# EAGLE schematic STM32F446 front pane - south - v3 (EAGLE 9.6.2)

## Sheet 1 of 3
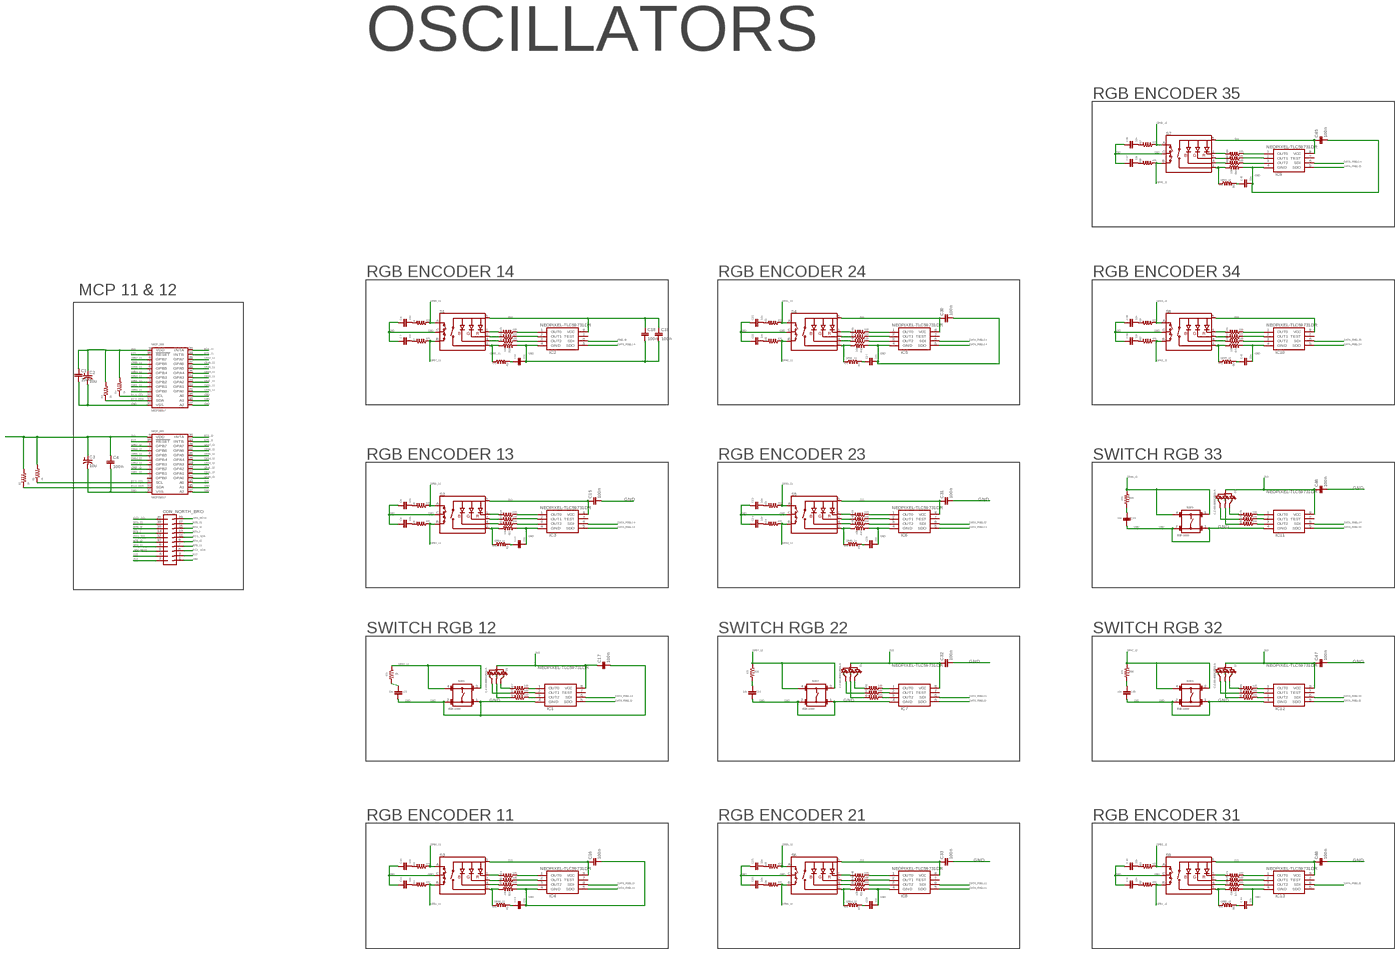
[diagram p0: schematic, sheet 1, overview]
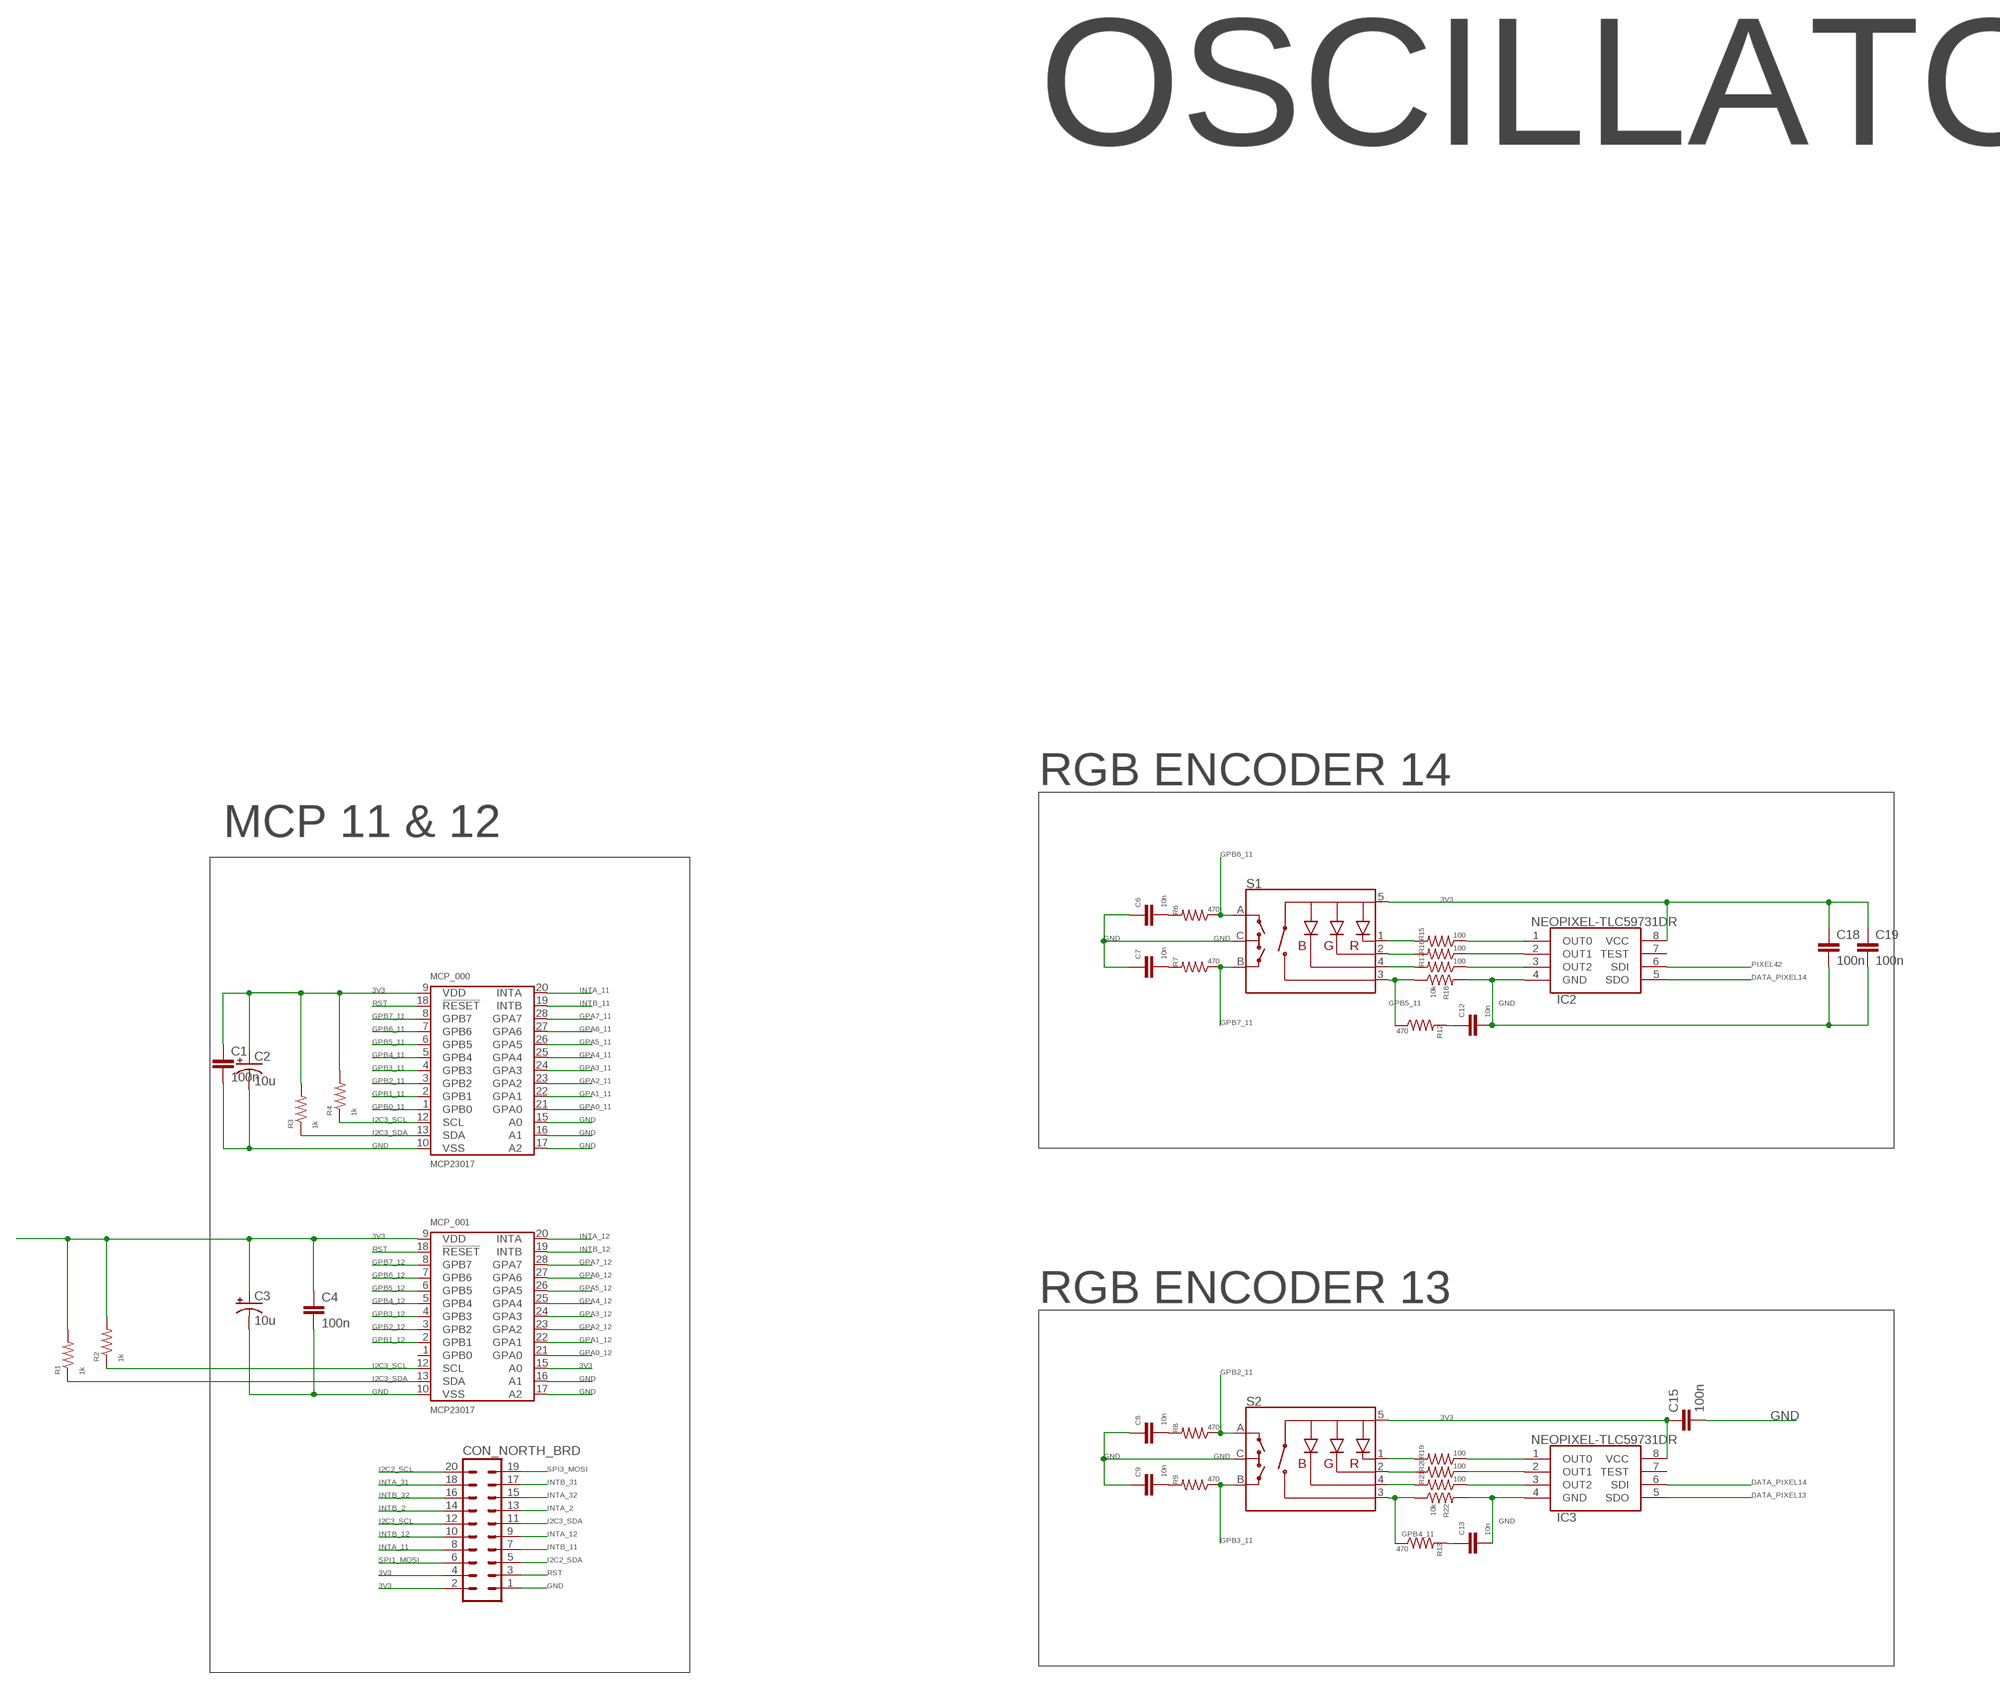
[diagram p1: schematic, sheet 1, part 1 of 4]
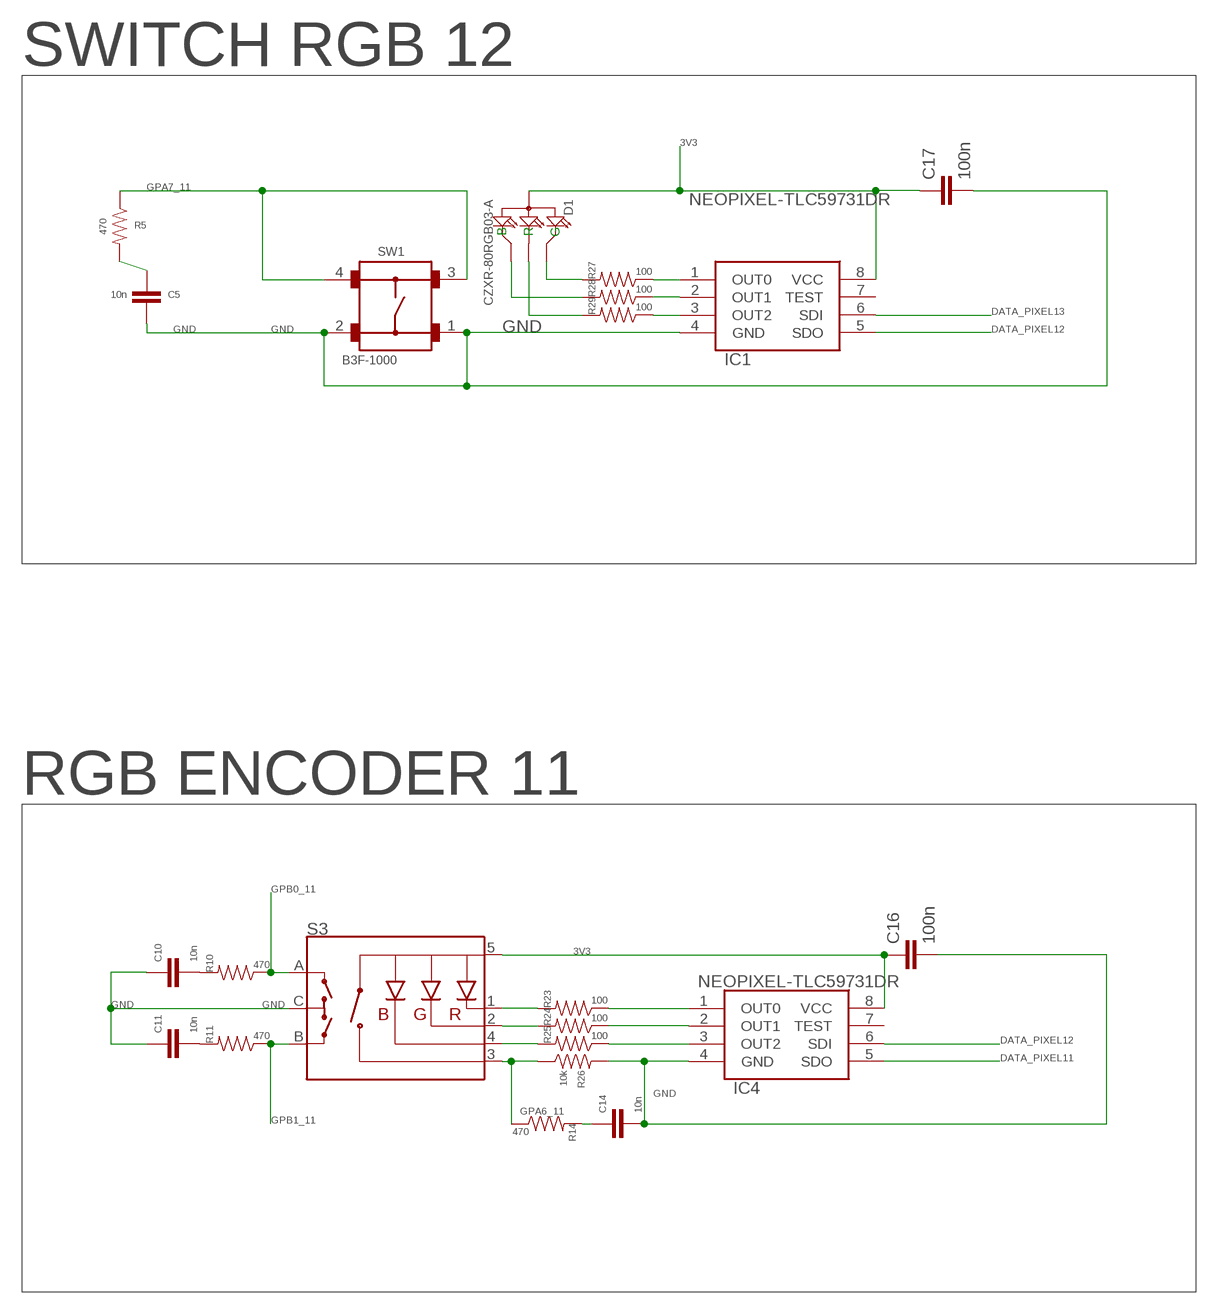
[diagram p2: schematic, sheet 1, part 2 of 4]
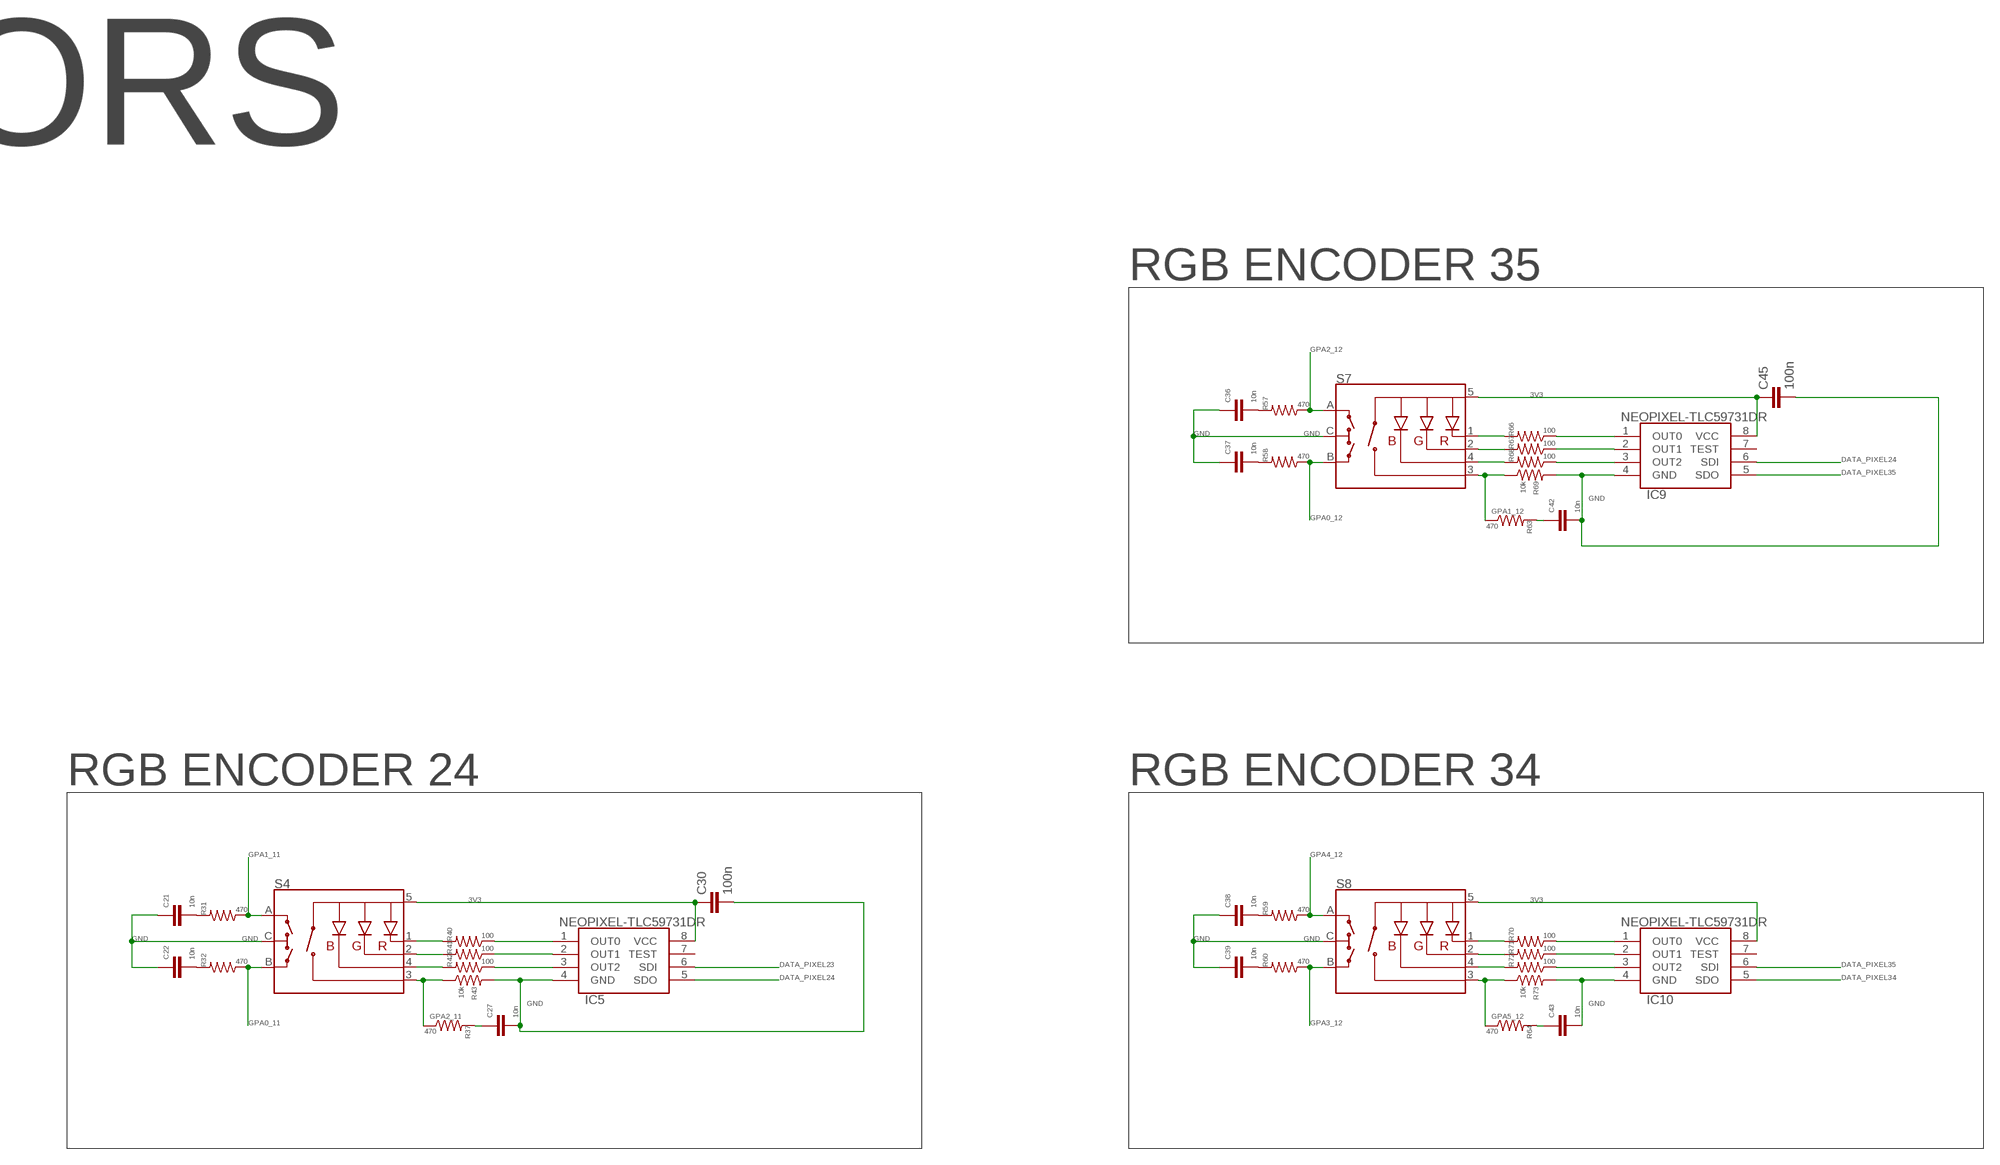
[diagram p3: schematic, sheet 1, part 3 of 4]
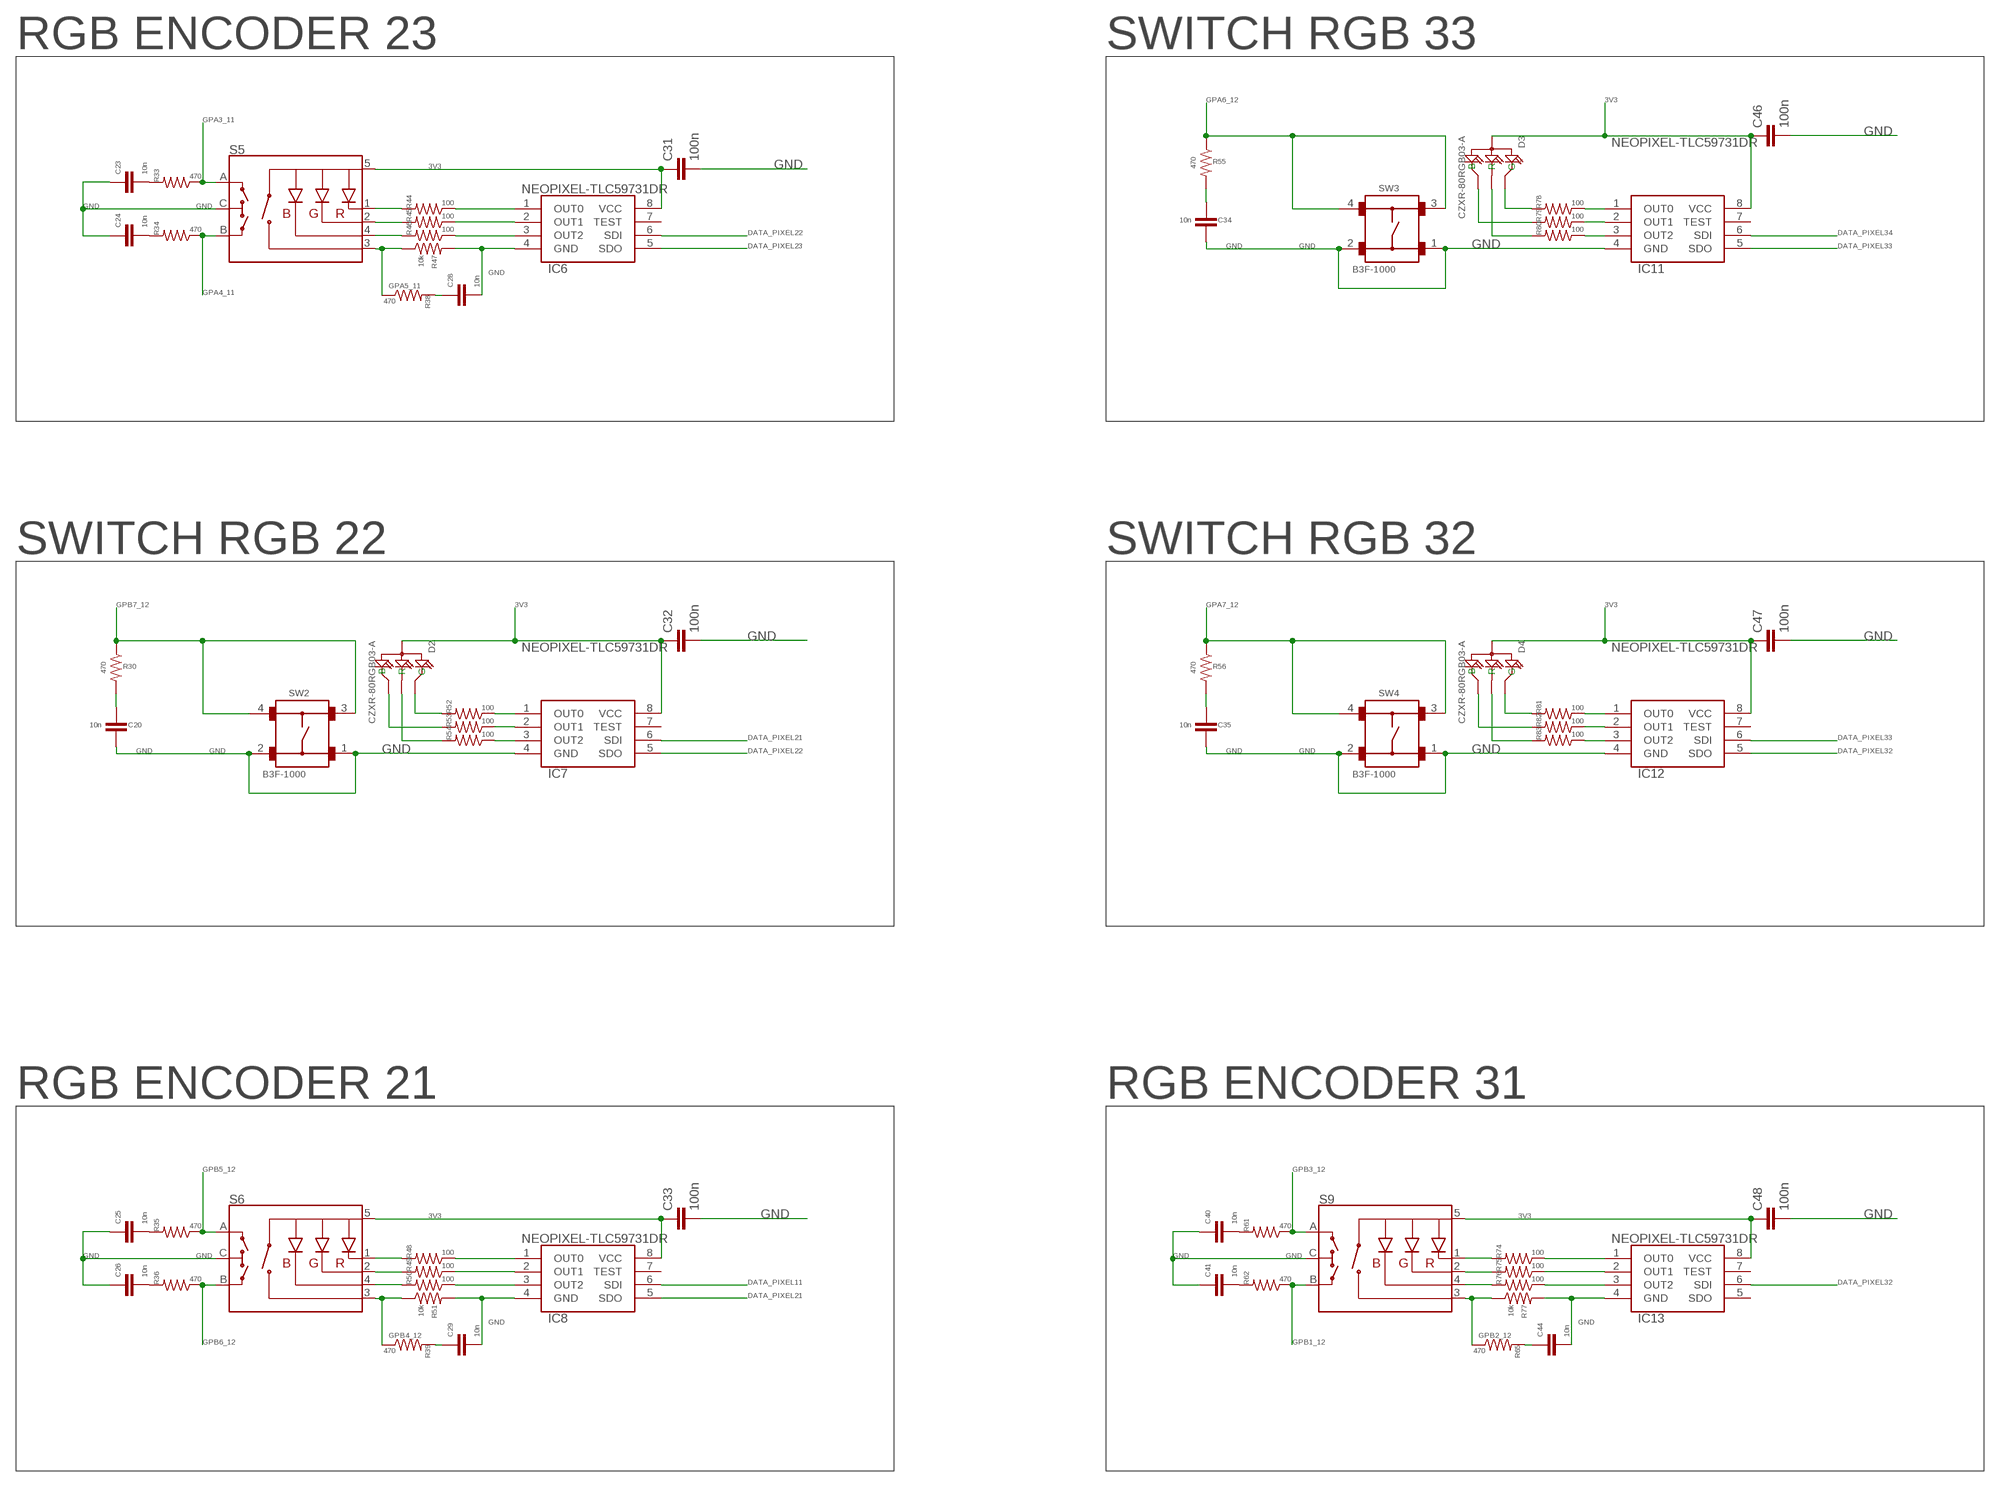
[diagram p4: schematic, sheet 1, part 4 of 4]

### Parts
C1  100n  PASSIF-CAP-0805  [0805-CAP]
C2  10u  PASSIF-CPOL-US2917  [CPOL2917]
C3  10u  PASSIF-CPOL-US2917  [CPOL2917]
C4  100n  PASSIF-CAP-0805  [0805-CAP]
C5  10n  PASSIF-CAP-0805  [0805-CAP]
C6  10n  PASSIF-CAP-0805  [0805-CAP]
C7  10n  PASSIF-CAP-0805  [0805-CAP]
C8  10n  PASSIF-CAP-0805  [0805-CAP]
C9  10n  PASSIF-CAP-0805  [0805-CAP]
C10  10n  PASSIF-CAP-0805  [0805-CAP]
C11  10n  PASSIF-CAP-0805  [0805-CAP]
C12  10n  PASSIF-CAP-0805  [0805-CAP]
C13  10n  PASSIF-CAP-0805  [0805-CAP]
C14  10n  PASSIF-CAP-0805  [0805-CAP]
C15  100n  PASSIF-CAP-1206  [1206]
C16  100n  PASSIF-CAP-1206  [1206]
C17  100n  PASSIF-CAP-1206  [1206]
C18  100n  PASSIF-CAP-1206  [1206]
C19  100n  PASSIF-CAP-1206  [1206]
C20  10n  PASSIF-CAP-0805  [0805-CAP]
C21  10n  PASSIF-CAP-0805  [0805-CAP]
C22  10n  PASSIF-CAP-0805  [0805-CAP]
C23  10n  PASSIF-CAP-0805  [0805-CAP]
C24  10n  PASSIF-CAP-0805  [0805-CAP]
C25  10n  PASSIF-CAP-0805  [0805-CAP]
C26  10n  PASSIF-CAP-0805  [0805-CAP]
C27  10n  PASSIF-CAP-0805  [0805-CAP]
C28  10n  PASSIF-CAP-0805  [0805-CAP]
C29  10n  PASSIF-CAP-0805  [0805-CAP]
C30  100n  PASSIF-CAP-1206  [1206]
C31  100n  PASSIF-CAP-1206  [1206]
C32  100n  PASSIF-CAP-1206  [1206]
C33  100n  PASSIF-CAP-1206  [1206]
C34  10n  PASSIF-CAP-0805  [0805-CAP]
C35  10n  PASSIF-CAP-0805  [0805-CAP]
C36  10n  PASSIF-CAP-0805  [0805-CAP]
C37  10n  PASSIF-CAP-0805  [0805-CAP]
C38  10n  PASSIF-CAP-0805  [0805-CAP]
C39  10n  PASSIF-CAP-0805  [0805-CAP]
C40  10n  PASSIF-CAP-0805  [0805-CAP]
C41  10n  PASSIF-CAP-0805  [0805-CAP]
C42  10n  PASSIF-CAP-0805  [0805-CAP]
C43  10n  PASSIF-CAP-0805  [0805-CAP]
C44  10n  PASSIF-CAP-0805  [0805-CAP]
C45  100n  PASSIF-CAP-1206  [1206]
C46  100n  PASSIF-CAP-1206  [1206]
C47  100n  PASSIF-CAP-1206  [1206]
C48  100n  PASSIF-CAP-1206  [1206]
CON_NORTH_BRD  MA10-2  [MA10-2]
D1  CZXR-80RGB03-A  DIP-LED-RGB-COMMON-ANODE(4P-D8MM)  [LED4-2.0-D8.0MM]
D2  CZXR-80RGB03-A  DIP-LED-RGB-COMMON-ANODE(4P-D8MM)  [LED4-2.0-D8.0MM]
D3  CZXR-80RGB03-A  DIP-LED-RGB-COMMON-ANODE(4P-D8MM)  [LED4-2.0-D8.0MM]
D4  CZXR-80RGB03-A  DIP-LED-RGB-COMMON-ANODE(4P-D8MM)  [LED4-2.0-D8.0MM]
IC1  NEOPIXEL-TLC59731DR  [SOIC127P600X175-8N]
IC2  NEOPIXEL-TLC59731DR  [SOIC127P600X175-8N]
IC3  NEOPIXEL-TLC59731DR  [SOIC127P600X175-8N]
IC4  NEOPIXEL-TLC59731DR  [SOIC127P600X175-8N]
IC5  NEOPIXEL-TLC59731DR  [SOIC127P600X175-8N]
IC6  NEOPIXEL-TLC59731DR  [SOIC127P600X175-8N]
IC7  NEOPIXEL-TLC59731DR  [SOIC127P600X175-8N]
IC8  NEOPIXEL-TLC59731DR  [SOIC127P600X175-8N]
IC9  NEOPIXEL-TLC59731DR  [SOIC127P600X175-8N]
IC10  NEOPIXEL-TLC59731DR  [SOIC127P600X175-8N]
IC11  NEOPIXEL-TLC59731DR  [SOIC127P600X175-8N]
IC12  NEOPIXEL-TLC59731DR  [SOIC127P600X175-8N]
IC13  NEOPIXEL-TLC59731DR  [SOIC127P600X175-8N]
MCP_000  MCP23017  [SOIC-28]
MCP_001  MCP23017  [SOIC-28]
R1  1k  R-US_R0805  [R0805]
R2  1k  R-US_R0805  [R0805]
R3  1k  R-US_R0805  [R0805]
R4  1k  R-US_R0805  [R0805]
R5  470  PASSIF-RESISTOR-1206  [1206]
R6  470  PASSIF-RESISTOR-1206  [1206]
R7  470  PASSIF-RESISTOR-1206  [1206]
R8  470  PASSIF-RESISTOR-1206  [1206]
R9  470  PASSIF-RESISTOR-1206  [1206]
R10  470  PASSIF-RESISTOR-1206  [1206]
R11  470  PASSIF-RESISTOR-1206  [1206]
R12  470  PASSIF-RESISTOR-1206  [1206]
R13  470  PASSIF-RESISTOR-1206  [1206]
R14  470  PASSIF-RESISTOR-1206  [1206]
R15  100  PASSIF-RESISTOR-1206  [1206]
R16  100  PASSIF-RESISTOR-1206  [1206]
R17  100  PASSIF-RESISTOR-1206  [1206]
R18  10k  PASSIF-RESISTOR-1206  [1206]
R19  100  PASSIF-RESISTOR-1206  [1206]
R20  100  PASSIF-RESISTOR-1206  [1206]
R21  100  PASSIF-RESISTOR-1206  [1206]
R22  10k  PASSIF-RESISTOR-1206  [1206]
R23  100  PASSIF-RESISTOR-1206  [1206]
R24  100  PASSIF-RESISTOR-1206  [1206]
R25  100  PASSIF-RESISTOR-1206  [1206]
R26  10k  PASSIF-RESISTOR-1206  [1206]
R27  100  PASSIF-RESISTOR-1206  [1206]
R28  100  PASSIF-RESISTOR-1206  [1206]
R29  100  PASSIF-RESISTOR-1206  [1206]
R30  470  PASSIF-RESISTOR-1206  [1206]
R31  470  PASSIF-RESISTOR-1206  [1206]
R32  470  PASSIF-RESISTOR-1206  [1206]
R33  470  PASSIF-RESISTOR-1206  [1206]
R34  470  PASSIF-RESISTOR-1206  [1206]
R35  470  PASSIF-RESISTOR-1206  [1206]
R36  470  PASSIF-RESISTOR-1206  [1206]
R37  470  PASSIF-RESISTOR-1206  [1206]
R38  470  PASSIF-RESISTOR-1206  [1206]
R39  470  PASSIF-RESISTOR-1206  [1206]
R40  100  PASSIF-RESISTOR-1206  [1206]
R41  100  PASSIF-RESISTOR-1206  [1206]
R42  100  PASSIF-RESISTOR-1206  [1206]
R43  10k  PASSIF-RESISTOR-1206  [1206]
R44  100  PASSIF-RESISTOR-1206  [1206]
R45  100  PASSIF-RESISTOR-1206  [1206]
R46  100  PASSIF-RESISTOR-1206  [1206]
R47  10k  PASSIF-RESISTOR-1206  [1206]
R48  100  PASSIF-RESISTOR-1206  [1206]
R49  100  PASSIF-RESISTOR-1206  [1206]
R50  100  PASSIF-RESISTOR-1206  [1206]
R51  10k  PASSIF-RESISTOR-1206  [1206]
R52  100  PASSIF-RESISTOR-1206  [1206]
R53  100  PASSIF-RESISTOR-1206  [1206]
R54  100  PASSIF-RESISTOR-1206  [1206]
R55  470  PASSIF-RESISTOR-1206  [1206]
R56  470  PASSIF-RESISTOR-1206  [1206]
R57  470  PASSIF-RESISTOR-1206  [1206]
R58  470  PASSIF-RESISTOR-1206  [1206]
R59  470  PASSIF-RESISTOR-1206  [1206]
R60  470  PASSIF-RESISTOR-1206  [1206]
R61  470  PASSIF-RESISTOR-1206  [1206]
R62  470  PASSIF-RESISTOR-1206  [1206]
R63  470  PASSIF-RESISTOR-1206  [1206]
R64  470  PASSIF-RESISTOR-1206  [1206]
R65  470  PASSIF-RESISTOR-1206  [1206]
R66  100  PASSIF-RESISTOR-1206  [1206]
R67  100  PASSIF-RESISTOR-1206  [1206]
R68  100  PASSIF-RESISTOR-1206  [1206]
R69  10k  PASSIF-RESISTOR-1206  [1206]
R70  100  PASSIF-RESISTOR-1206  [1206]
R71  100  PASSIF-RESISTOR-1206  [1206]
R72  100  PASSIF-RESISTOR-1206  [1206]
R73  10k  PASSIF-RESISTOR-1206  [1206]
R74  100  PASSIF-RESISTOR-1206  [1206]
R75  100  PASSIF-RESISTOR-1206  [1206]
R76  100  PASSIF-RESISTOR-1206  [1206]
R77  10k  PASSIF-RESISTOR-1206  [1206]
R78  100  PASSIF-RESISTOR-1206  [1206]
R79  100  PASSIF-RESISTOR-1206  [1206]
R80  100  PASSIF-RESISTOR-1206  [1206]
R81  100  PASSIF-RESISTOR-1206  [1206]
R82  100  PASSIF-RESISTOR-1206  [1206]
R83  100  PASSIF-RESISTOR-1206  [1206]
S1  ENCODER-RGB-SWITCH-NO_NUT  [ENCODER_LED_3]
S2  ENCODER-RGB-SWITCH-NO_NUT  [ENCODER_LED_3]
S3  ENCODER-RGB-SWITCH-NO_NUT  [ENCODER_LED_3]
S4  ENCODER-RGB-SWITCH-NO_NUT  [ENCODER_LED_3]
S5  ENCODER-RGB-SWITCH-NO_NUT  [ENCODER_LED_3]
S6  ENCODER-RGB-SWITCH-NO_NUT  [ENCODER_LED_3]
S7  ENCODER-RGB-SWITCH-NO_NUT  [ENCODER_LED_3]
S8  ENCODER-RGB-SWITCH-NO_NUT  [ENCODER_LED_3]
S9  ENCODER-RGB-SWITCH-NO_NUT  [ENCODER_LED_3]
SW1  B3F-1000  [B3F-1000]
SW2  B3F-1000  [B3F-1000]
SW3  B3F-1000  [B3F-1000]
SW4  B3F-1000  [B3F-1000]

### Nets
3V3: C1.1 C2.+ C3.+ C4.1 C15.1 C16.1 C17.1 C18.1 C19.1 C30.1 C31.1 C32.1 C33.1 C45.1 C46.1 C47.1 C48.1 CON_NORTH_BRD.2 CON_NORTH_BRD.4 D1.2(+) D2.2(+) D3.2(+) D4.2(+) IC1.8(VCC) IC2.8(VCC) IC3.8(VCC) IC4.8(VCC) IC5.8(VCC) IC6.8(VCC) IC7.8(VCC) IC8.8(VCC) IC9.8(VCC) IC10.8(VCC) IC11.8(VCC) IC12.8(VCC) IC13.8(VCC) MCP_000.9(VDD) MCP_001.9(VDD) MCP_001.15(A0) R1.2 R2.2 R3.2 R4.2 S1.5(+) S2.5(+) S3.5(+) S4.5(+) S5.5(+) S6.5(+) S7.5(+) S8.5(+) S9.5(+) ; also sheet 2,3
DATA_PIXEL11: IC4.5(SDO) IC8.6(SDI)
DATA_PIXEL12: IC1.5(SDO) IC4.6(SDI)
DATA_PIXEL13: IC1.6(SDI) IC3.5(SDO)
DATA_PIXEL14: IC2.5(SDO) IC3.6(SDI)
DATA_PIXEL21: IC7.6(SDI) IC8.5(SDO)
DATA_PIXEL22: IC6.6(SDI) IC7.5(SDO)
DATA_PIXEL23: IC5.6(SDI) IC6.5(SDO)
DATA_PIXEL24: IC5.5(SDO) IC9.6(SDI)
DATA_PIXEL32: IC12.5(SDO) IC13.6(SDI)
DATA_PIXEL33: IC11.5(SDO) IC12.6(SDI)
DATA_PIXEL34: IC10.5(SDO) IC11.6(SDI)
DATA_PIXEL35: IC9.5(SDO) IC10.6(SDI)
GND: C1.2 C2.- C3.- C4.2 C5.1 C6.1 C7.1 C8.1 C9.1 C10.1 C11.1 C12.2 C13.2 C14.2 C15.2 C16.2 C17.2 C18.2 C19.2 C20.1 C21.1 C22.1 C23.1 C24.1 C25.1 C26.1 C27.2 C28.2 C29.2 C30.2 C31.2 C32.2 C33.2 C34.1 C35.1 C36.1 C37.1 C38.1 C39.1 C40.1 C41.1 C42.2 C43.2 C44.2 C45.2 C46.2 C47.2 C48.2 CON_NORTH_BRD.1 IC1.4(GND) IC2.4(GND) IC3.4(GND) IC4.4(GND) IC5.4(GND) IC6.4(GND) IC7.4(GND) IC8.4(GND) IC9.4(GND) IC10.4(GND) IC11.4(GND) IC12.4(GND) IC13.4(GND) MCP_000.10(VSS) MCP_000.15(A0) MCP_000.16(A1) MCP_000.17(A2) MCP_001.10(VSS) MCP_001.16(A1) MCP_001.17(A2) R18.2 R22.2 R26.2 R43.2 R47.2 R51.2 R69.2 R73.2 R77.2 S1.C S2.C S3.C S4.C S5.C S6.C S7.C S8.C S9.C SW1.1 SW1.2 SW2.1 SW2.2 SW3.1 SW3.2 SW4.1 SW4.2 ; also sheet 2,3
GPA0_11: MCP_000.21(GPA0) R32.1 S4.B
GPA0_12: MCP_001.21(GPA0) R58.1 S7.B
GPA1_11: MCP_000.22(GPA1) R31.1 S4.A
GPA1_12: MCP_001.22(GPA1) R63.1 R69.1 S7.3(SW)
GPA2_11: MCP_000.23(GPA2) R37.1 R43.1 S4.3(SW)
GPA2_12: MCP_001.23(GPA2) R57.1 S7.A
GPA3_11: MCP_000.24(GPA3) R33.1 S5.A
GPA3_12: MCP_001.24(GPA3) R60.1 S8.B
GPA4_11: MCP_000.25(GPA4) R34.1 S5.B
GPA4_12: MCP_001.25(GPA4) R59.1 S8.A
GPA5_11: MCP_000.26(GPA5) R38.1 R47.1 S5.3(SW)
GPA5_12: MCP_001.26(GPA5) R64.1 R73.1 S8.3(SW)
GPA6_11: MCP_000.27(GPA6) R14.1 R26.1 S3.3(SW)
GPA6_12: MCP_001.27(GPA6) R55.1 SW3.3 SW3.4
GPA7_11: MCP_000.28(GPA7) R5.1 SW1.3 SW1.4
GPA7_12: MCP_001.28(GPA7) R56.1 SW4.3 SW4.4
GPB0_11: MCP_000.1(GPB0) R10.1 S3.A
GPB1_11: MCP_000.2(GPB1) R11.1 S3.B
GPB1_12: MCP_001.2(GPB1) R62.1 S9.B
GPB2_11: MCP_000.3(GPB2) R8.1 S2.A
GPB2_12: MCP_001.3(GPB2) R65.1 R77.1 S9.3(SW)
GPB3_11: MCP_000.4(GPB3) R9.1 S2.B
GPB3_12: MCP_001.4(GPB3) R61.1 S9.A
GPB4_11: MCP_000.5(GPB4) R13.1 R22.1 S2.3(SW)
GPB4_12: MCP_001.5(GPB4) R39.1 R51.1 S6.3(SW)
GPB5_11: MCP_000.6(GPB5) R12.1 R18.1 S1.3(SW)
GPB5_12: MCP_001.6(GPB5) R35.1 S6.A
GPB6_11: MCP_000.7(GPB6) R6.1 S1.A
GPB6_12: MCP_001.7(GPB6) R36.1 S6.B
GPB7_11: MCP_000.8(GPB7) R7.1 S1.B
GPB7_12: MCP_001.8(GPB7) R30.1 SW2.3 SW2.4
I2C2_SCL: CON_NORTH_BRD.20 ; also sheet 2,3
I2C2_SDA: CON_NORTH_BRD.5 ; also sheet 2,3
I2C3_SCL: CON_NORTH_BRD.12 MCP_000.12(SCL) MCP_001.12(SCL) R2.1 R4.1
I2C3_SDA: CON_NORTH_BRD.11 MCP_000.13(SDA) MCP_001.13(SDA) R1.1 R3.1
INTA_2: CON_NORTH_BRD.13 ; also sheet 2
INTA_11: CON_NORTH_BRD.8 MCP_000.20(INTA)
INTA_12: CON_NORTH_BRD.9 MCP_001.20(INTA)
INTA_31: CON_NORTH_BRD.18 ; also sheet 3
INTA_32: CON_NORTH_BRD.15 ; also sheet 3
INTB_2: CON_NORTH_BRD.14 ; also sheet 2
INTB_11: CON_NORTH_BRD.7 MCP_000.19(INTB)
INTB_12: CON_NORTH_BRD.10 MCP_001.19(INTB)
INTB_31: CON_NORTH_BRD.17 ; also sheet 3
INTB_32: CON_NORTH_BRD.16 ; also sheet 3
N$710: IC12.1(OUT0) R81.1
N$711: IC12.2(OUT1) R82.1
N$712: R23.2 S3.1(-R)
N$713: R24.2 S3.2(-G)
N$714: R25.2 S3.4(-B)
N$715: IC4.1(OUT0) R23.1
N$716: IC4.2(OUT1) R24.1
N$717: IC4.3(OUT2) R25.1
N$718: C10.2 R10.2
N$719: C11.2 R11.2
N$720: C14.1 R14.2
N$1069: R19.2 S2.1(-R)
N$1070: R20.2 S2.2(-G)
N$1071: R21.2 S2.4(-B)
N$1072: IC3.1(OUT0) R19.1
N$1073: IC3.2(OUT1) R20.1
N$1074: IC3.3(OUT2) R21.1
N$1075: C8.2 R8.2
N$1076: C9.2 R9.2
N$1077: C13.1 R13.2
N$1252: R15.2 S1.1(-R)
N$1253: R16.2 S1.2(-G)
N$1254: R17.2 S1.4(-B)
N$1255: IC2.1(OUT0) R15.1
N$1256: IC2.2(OUT1) R16.1
N$1257: IC2.3(OUT2) R17.1
N$1258: C6.2 R6.2
N$1259: C7.2 R7.2
N$1260: C12.1 R12.2
N$1435: IC12.3(OUT2) R83.1
N$1436: C35.2 R56.2
N$1437: D4.1(R) R83.2
N$1438: D4.4(B) R82.2
N$1439: D4.3(G) R81.2
N$1614: IC1.1(OUT0) R27.1
N$1615: IC1.2(OUT1) R28.1
N$1616: IC1.3(OUT2) R29.1
N$1617: C5.2 R5.2
N$1618: R48.2 S6.1(-R)
N$1619: R49.2 S6.2(-G)
N$1620: R50.2 S6.4(-B)
N$1621: IC8.1(OUT0) R48.1
N$1622: IC8.2(OUT1) R49.1
N$1623: IC8.3(OUT2) R50.1
N$1624: C25.2 R35.2
N$1625: C26.2 R36.2
N$1626: C29.1 R39.2
N$1801: D1.1(R) R29.2
N$1802: D1.4(B) R28.2
N$1803: D1.3(G) R27.2
N$1984: R44.2 S5.1(-R)
N$1985: R45.2 S5.2(-G)
N$1986: R46.2 S5.4(-B)
N$1987: IC6.1(OUT0) R44.1
N$1988: IC6.2(OUT1) R45.1
N$1989: IC6.3(OUT2) R46.1
N$1990: C23.2 R33.2
N$1991: C24.2 R34.2
N$1992: C28.1 R38.2
N$2342: IC7.1(OUT0) R52.1
N$2343: IC7.2(OUT1) R53.1
N$2344: IC7.3(OUT2) R54.1
N$2345: C20.2 R30.2
N$2346: D2.1(R) R54.2
N$2347: D2.4(B) R53.2
N$2348: D2.3(G) R52.2
N$2350: R40.2 S4.1(-R)
N$2351: R41.2 S4.2(-G)
N$2352: R42.2 S4.4(-B)
N$2353: IC5.1(OUT0) R40.1
N$2354: IC5.2(OUT1) R41.1
N$2355: IC5.3(OUT2) R42.1
N$2356: C21.2 R31.2
N$2357: C22.2 R32.2
N$2358: C27.1 R37.2
N$2716: R74.2 S9.1(-R)
N$2717: R75.2 S9.2(-G)
N$2718: R76.2 S9.4(-B)
N$2719: IC13.1(OUT0) R74.1
N$2720: IC13.2(OUT1) R75.1
N$2721: IC13.3(OUT2) R76.1
N$2722: C40.2 R61.2
N$2723: C41.2 R62.2
N$2724: C44.1 R65.2
N$3070: IC11.1(OUT0) R78.1
N$3071: IC11.2(OUT1) R79.1
N$3072: IC11.3(OUT2) R80.1
N$3073: C34.2 R55.2
N$3074: D3.1(R) R80.2
N$3075: D3.4(B) R79.2
N$3076: D3.3(G) R78.2
N$3082: R70.2 S8.1(-R)
N$3083: R71.2 S8.2(-G)
N$3084: R72.2 S8.4(-B)
N$3085: IC10.1(OUT0) R70.1
N$3086: IC10.2(OUT1) R71.1
N$3087: IC10.3(OUT2) R72.1
N$3088: C38.2 R59.2
N$3089: C39.2 R60.2
N$3090: C43.1 R64.2
N$3448: R66.2 S7.1(-R)
N$3449: R67.2 S7.2(-G)
N$3450: R68.2 S7.4(-B)
N$3451: IC9.1(OUT0) R66.1
N$3452: IC9.2(OUT1) R67.1
N$3453: IC9.3(OUT2) R68.1
N$3454: C36.2 R57.2
N$3455: C37.2 R58.2
N$3456: C42.1 R63.2
PIXEL42: IC2.6(SDI) ; also sheet 2
RST: CON_NORTH_BRD.3 MCP_000.18(!RESET) MCP_001.18(!RESET) ; also sheet 2,3
SPI1_MOSI: CON_NORTH_BRD.6 ; also sheet 2
SPI3_MOSI: CON_NORTH_BRD.19 ; also sheet 3
Unconnected: IC1.7(TEST) IC2.7(TEST) IC3.7(TEST) IC4.7(TEST) IC5.7(TEST) IC6.7(TEST) IC7.7(TEST) IC8.7(TEST) IC9.7(TEST) IC10.7(TEST) IC11.7(TEST) IC12.7(TEST) IC13.5(SDO) IC13.7(TEST) MCP_001.1(GPB0)

### Notes on the sheet
- OSCILLATORS
- RGB ENCODER 35
- RGB ENCODER 14 | RGB ENCODER 24 | RGB ENCODER 34
- MCP 11 & 12
- RGB ENCODER 13 | RGB ENCODER 23 | SWITCH RGB 33
- SWITCH RGB 12 | SWITCH RGB 22 | SWITCH RGB 32
- RGB ENCODER 11 | RGB ENCODER 21 | RGB ENCODER 31

## Sheet 2 of 3
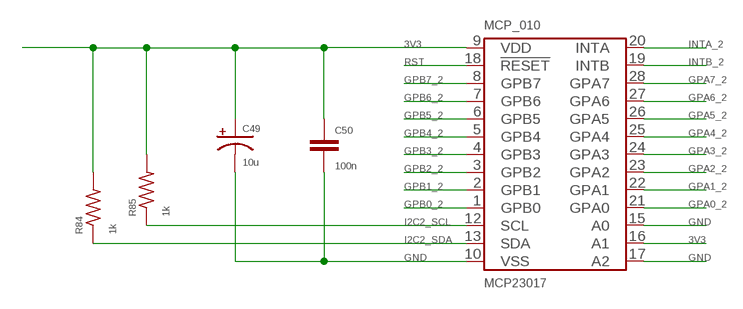
[diagram p5: schematic, sheet 2, part 1 of 2]
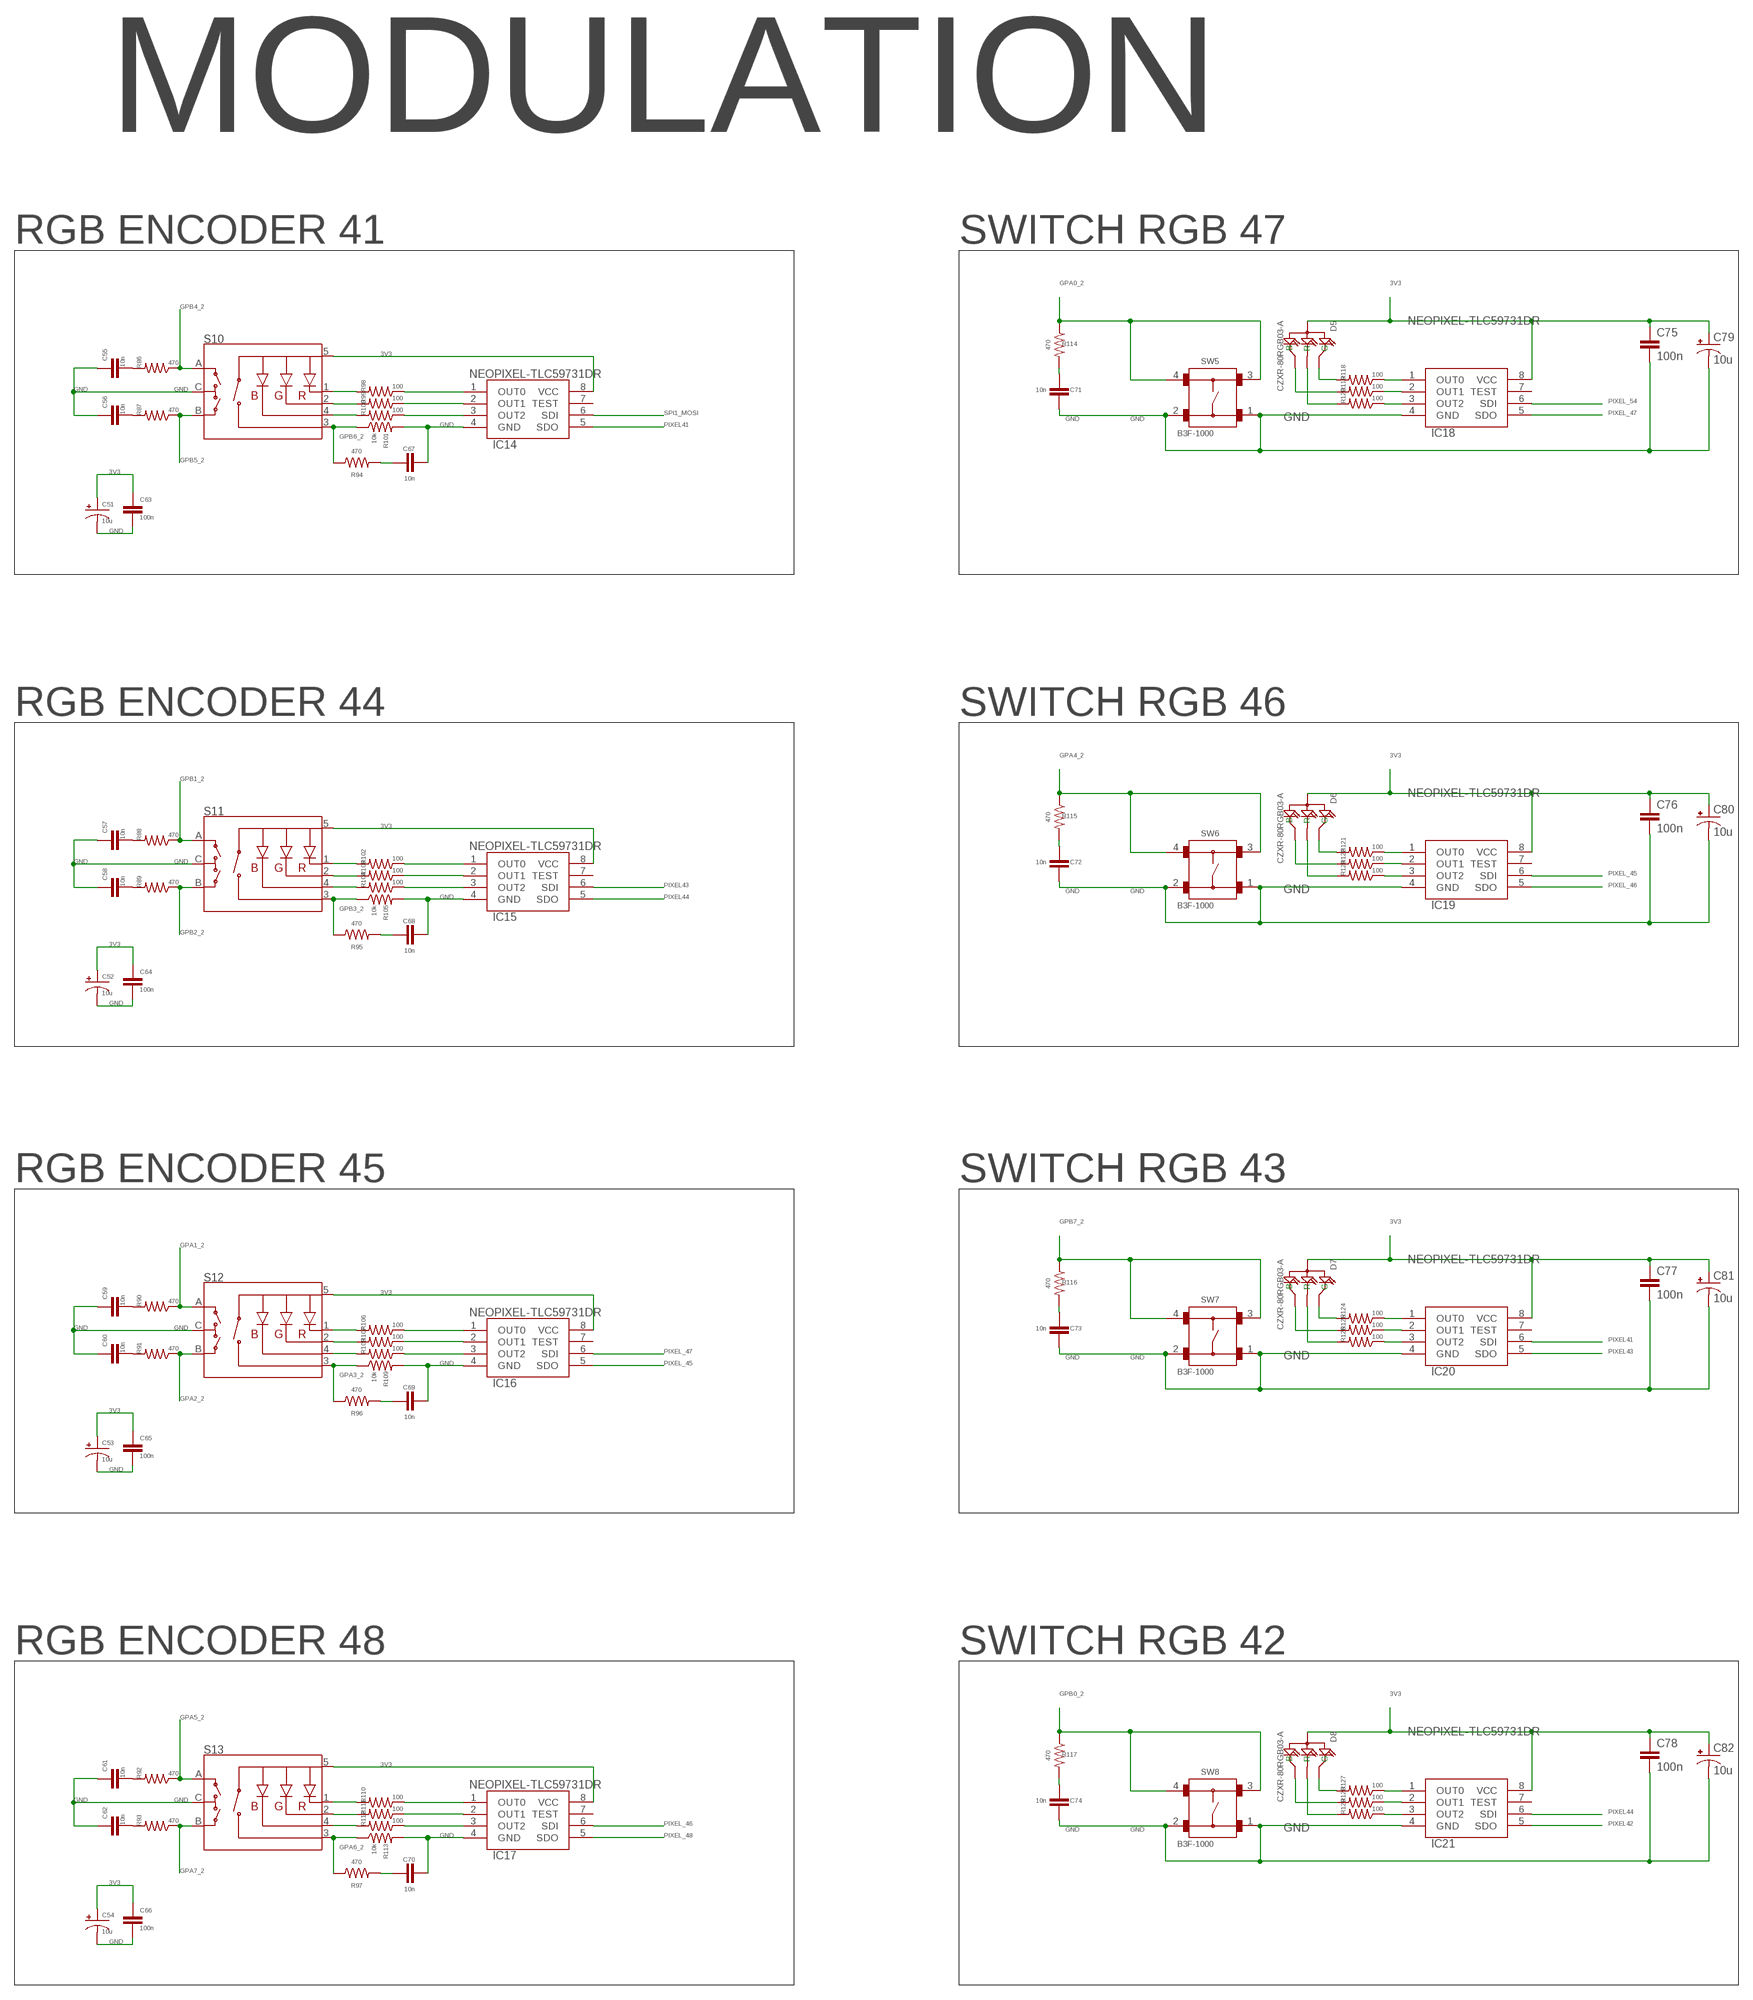
[diagram p6: schematic, sheet 2, part 2 of 2]

### Parts
C49  10u  PASSIF-CPOL-US2917  [CPOL2917]
C50  100n  PASSIF-CAP-0805  [0805-CAP]
C51  10u  PASSIF-CPOL-US2917  [CPOL2917]
C52  10u  PASSIF-CPOL-US2917  [CPOL2917]
C53  10u  PASSIF-CPOL-US2917  [CPOL2917]
C54  10u  PASSIF-CPOL-US2917  [CPOL2917]
C55  10n  PASSIF-CAP-0805  [0805-CAP]
C56  10n  PASSIF-CAP-0805  [0805-CAP]
C57  10n  PASSIF-CAP-0805  [0805-CAP]
C58  10n  PASSIF-CAP-0805  [0805-CAP]
C59  10n  PASSIF-CAP-0805  [0805-CAP]
C60  10n  PASSIF-CAP-0805  [0805-CAP]
C61  10n  PASSIF-CAP-0805  [0805-CAP]
C62  10n  PASSIF-CAP-0805  [0805-CAP]
C63  100n  PASSIF-CAP-0805  [0805-CAP]
C64  100n  PASSIF-CAP-0805  [0805-CAP]
C65  100n  PASSIF-CAP-0805  [0805-CAP]
C66  100n  PASSIF-CAP-0805  [0805-CAP]
C67  10n  PASSIF-CAP-0805  [0805-CAP]
C68  10n  PASSIF-CAP-0805  [0805-CAP]
C69  10n  PASSIF-CAP-0805  [0805-CAP]
C70  10n  PASSIF-CAP-0805  [0805-CAP]
C71  10n  PASSIF-CAP-0805  [0805-CAP]
C72  10n  PASSIF-CAP-0805  [0805-CAP]
C73  10n  PASSIF-CAP-0805  [0805-CAP]
C74  10n  PASSIF-CAP-0805  [0805-CAP]
C75  100n  PASSIF-CAP-0805  [0805-CAP]
C76  100n  PASSIF-CAP-0805  [0805-CAP]
C77  100n  PASSIF-CAP-0805  [0805-CAP]
C78  100n  PASSIF-CAP-0805  [0805-CAP]
C79  10u  PASSIF-CPOL-US2917  [CPOL2917]
C80  10u  PASSIF-CPOL-US2917  [CPOL2917]
C81  10u  PASSIF-CPOL-US2917  [CPOL2917]
C82  10u  PASSIF-CPOL-US2917  [CPOL2917]
D5  CZXR-80RGB03-A  DIP-LED-RGB-COMMON-ANODE(4P-D8MM)  [LED4-2.0-D8.0MM]
D6  CZXR-80RGB03-A  DIP-LED-RGB-COMMON-ANODE(4P-D8MM)  [LED4-2.0-D8.0MM]
D7  CZXR-80RGB03-A  DIP-LED-RGB-COMMON-ANODE(4P-D8MM)  [LED4-2.0-D8.0MM]
D8  CZXR-80RGB03-A  DIP-LED-RGB-COMMON-ANODE(4P-D8MM)  [LED4-2.0-D8.0MM]
IC14  NEOPIXEL-TLC59731DR  [SOIC127P600X175-8N]
IC15  NEOPIXEL-TLC59731DR  [SOIC127P600X175-8N]
IC16  NEOPIXEL-TLC59731DR  [SOIC127P600X175-8N]
IC17  NEOPIXEL-TLC59731DR  [SOIC127P600X175-8N]
IC18  NEOPIXEL-TLC59731DR  [SOIC127P600X175-8N]
IC19  NEOPIXEL-TLC59731DR  [SOIC127P600X175-8N]
IC20  NEOPIXEL-TLC59731DR  [SOIC127P600X175-8N]
IC21  NEOPIXEL-TLC59731DR  [SOIC127P600X175-8N]
MCP_010  MCP23017  [SOIC-28]
R84  1k  R-US_R0805  [R0805]
R85  1k  R-US_R0805  [R0805]
R86  470  PASSIF-RESISTOR-1206  [1206]
R87  470  PASSIF-RESISTOR-1206  [1206]
R88  470  PASSIF-RESISTOR-1206  [1206]
R89  470  PASSIF-RESISTOR-1206  [1206]
R90  470  PASSIF-RESISTOR-1206  [1206]
R91  470  PASSIF-RESISTOR-1206  [1206]
R92  470  PASSIF-RESISTOR-1206  [1206]
R93  470  PASSIF-RESISTOR-1206  [1206]
R94  470  PASSIF-RESISTOR-1206  [1206]
R95  470  PASSIF-RESISTOR-1206  [1206]
R96  470  PASSIF-RESISTOR-1206  [1206]
R97  470  PASSIF-RESISTOR-1206  [1206]
R98  100  PASSIF-RESISTOR-1206  [1206]
R99  100  PASSIF-RESISTOR-1206  [1206]
R100  100  PASSIF-RESISTOR-1206  [1206]
R101  10k  PASSIF-RESISTOR-1206  [1206]
R102  100  PASSIF-RESISTOR-1206  [1206]
R103  100  PASSIF-RESISTOR-1206  [1206]
R104  100  PASSIF-RESISTOR-1206  [1206]
R105  10k  PASSIF-RESISTOR-1206  [1206]
R106  100  PASSIF-RESISTOR-1206  [1206]
R107  100  PASSIF-RESISTOR-1206  [1206]
R108  100  PASSIF-RESISTOR-1206  [1206]
R109  10k  PASSIF-RESISTOR-1206  [1206]
R110  100  PASSIF-RESISTOR-1206  [1206]
R111  100  PASSIF-RESISTOR-1206  [1206]
R112  100  PASSIF-RESISTOR-1206  [1206]
R113  10k  PASSIF-RESISTOR-1206  [1206]
R114  470  PASSIF-RESISTOR-1206  [1206]
R115  470  PASSIF-RESISTOR-1206  [1206]
R116  470  PASSIF-RESISTOR-1206  [1206]
R117  470  PASSIF-RESISTOR-1206  [1206]
R118  100  PASSIF-RESISTOR-1206  [1206]
R119  100  PASSIF-RESISTOR-1206  [1206]
R120  100  PASSIF-RESISTOR-1206  [1206]
R121  100  PASSIF-RESISTOR-1206  [1206]
R122  100  PASSIF-RESISTOR-1206  [1206]
R123  100  PASSIF-RESISTOR-1206  [1206]
R124  100  PASSIF-RESISTOR-1206  [1206]
R125  100  PASSIF-RESISTOR-1206  [1206]
R126  100  PASSIF-RESISTOR-1206  [1206]
R127  100  PASSIF-RESISTOR-1206  [1206]
R128  100  PASSIF-RESISTOR-1206  [1206]
R129  100  PASSIF-RESISTOR-1206  [1206]
S10  ENCODER-RGB-SWITCH-NO_NUT  [ENCODER_LED_3]
S11  ENCODER-RGB-SWITCH-NO_NUT  [ENCODER_LED_3]
S12  ENCODER-RGB-SWITCH-NO_NUT  [ENCODER_LED_3]
S13  ENCODER-RGB-SWITCH-NO_NUT  [ENCODER_LED_3]
SW5  B3F-1000  [B3F-1000]
SW6  B3F-1000  [B3F-1000]
SW7  B3F-1000  [B3F-1000]
SW8  B3F-1000  [B3F-1000]

### Nets
3V3: C49.+ C50.1 C51.+ C52.+ C53.+ C54.+ C63.1 C64.1 C65.1 C66.1 C75.1 C76.1 C77.1 C78.1 C79.+ C80.+ C81.+ C82.+ D5.2(+) D6.2(+) D7.2(+) D8.2(+) IC14.8(VCC) IC15.8(VCC) IC16.8(VCC) IC17.8(VCC) IC18.8(VCC) IC19.8(VCC) IC20.8(VCC) IC21.8(VCC) MCP_010.9(VDD) MCP_010.16(A1) R84.2 R85.2 S10.5(+) S11.5(+) S12.5(+) S13.5(+) ; also sheet 1,3
GND: C49.- C50.2 C51.- C52.- C53.- C54.- C55.1 C56.1 C57.1 C58.1 C59.1 C60.1 C61.1 C62.1 C63.2 C64.2 C65.2 C66.2 C67.2 C68.2 C69.2 C70.2 C71.1 C72.1 C73.1 C74.1 C75.2 C76.2 C77.2 C78.2 C79.- C80.- C81.- C82.- IC14.4(GND) IC15.4(GND) IC16.4(GND) IC17.4(GND) IC18.4(GND) IC19.4(GND) IC20.4(GND) IC21.4(GND) MCP_010.10(VSS) MCP_010.15(A0) MCP_010.17(A2) R101.2 R105.2 R109.2 R113.2 S10.C S11.C S12.C S13.C SW5.1 SW5.2 SW6.1 SW6.2 SW7.1 SW7.2 SW8.1 SW8.2 ; also sheet 1,3
GPA0_2: MCP_010.21(GPA0) R114.1 SW5.3 SW5.4
GPA1_2: MCP_010.22(GPA1) R90.1 S12.A
GPA2_2: MCP_010.23(GPA2) R91.1 S12.B
GPA3_2: MCP_010.24(GPA3) R96.1 R109.1 S12.3(SW)
GPA4_2: MCP_010.25(GPA4) R115.1 SW6.3 SW6.4
GPA5_2: MCP_010.26(GPA5) R92.1 S13.A
GPA6_2: MCP_010.27(GPA6) R97.1 R113.1 S13.3(SW)
GPA7_2: MCP_010.28(GPA7) R93.1 S13.B
GPB0_2: MCP_010.1(GPB0) R117.1 SW8.3 SW8.4
GPB1_2: MCP_010.2(GPB1) R88.1 S11.A
GPB2_2: MCP_010.3(GPB2) R89.1 S11.B
GPB3_2: MCP_010.4(GPB3) R95.1 R105.1 S11.3(SW)
GPB4_2: MCP_010.5(GPB4) R86.1 S10.A
GPB5_2: MCP_010.6(GPB5) R87.1 S10.B
GPB6_2: MCP_010.7(GPB6) R94.1 R101.1 S10.3(SW)
GPB7_2: MCP_010.8(GPB7) R116.1 SW7.3 SW7.4
I2C2_SCL: MCP_010.12(SCL) R85.1 ; also sheet 1,3
I2C2_SDA: MCP_010.13(SDA) R84.1 ; also sheet 1,3
INTA_2: MCP_010.20(INTA) ; also sheet 1
INTB_2: MCP_010.19(INTB) ; also sheet 1
N$709: IC21.1(OUT0) R127.1
N$1978: IC21.2(OUT1) R128.1
N$2709: R98.2 S10.1(-R)
N$2710: R99.2 S10.2(-G)
N$2711: R100.2 S10.4(-B)
N$2712: IC14.1(OUT0) R98.1
N$2713: IC14.2(OUT1) R99.1
N$2714: IC14.3(OUT2) R100.1
N$2715: C55.2 R86.2
N$2899: C56.2 R87.2
N$2900: C67.1 R94.2
N$3814: R102.2 S11.1(-R)
N$3815: R103.2 S11.2(-G)
N$3816: R104.2 S11.4(-B)
N$3817: IC15.1(OUT0) R102.1
N$3818: IC15.2(OUT1) R103.1
N$3819: IC15.3(OUT2) R104.1
N$3820: C57.2 R88.2
N$3821: C58.2 R89.2
N$3822: C68.1 R95.2
N$4867: R106.2 S12.1(-R)
N$4868: R107.2 S12.2(-G)
N$4869: R108.2 S12.4(-B)
N$4870: IC16.1(OUT0) R106.1
N$4871: IC16.2(OUT1) R107.1
N$4872: IC16.3(OUT2) R108.1
N$4873: C59.2 R90.2
N$4874: C60.2 R91.2
N$4875: C69.1 R96.2
N$5233: R110.2 S13.1(-R)
N$5234: R111.2 S13.2(-G)
N$5235: R112.2 S13.4(-B)
N$5236: IC17.1(OUT0) R110.1
N$5237: IC17.2(OUT1) R111.1
N$5238: IC17.3(OUT2) R112.1
N$5239: C61.2 R92.2
N$5240: C62.2 R93.2
N$5241: C70.1 R97.2
N$6148: IC21.3(OUT2) R129.1
N$6149: C74.2 R117.2
N$6150: D8.1(R) R129.2
N$6151: D8.4(B) R128.2
N$6152: D8.3(G) R127.2
N$9432: IC20.1(OUT0) R124.1
N$9433: IC20.2(OUT1) R125.1
N$9434: IC20.3(OUT2) R126.1
N$9435: C73.2 R116.2
N$9436: D7.1(R) R126.2
N$9437: D7.4(B) R125.2
N$9438: D7.3(G) R124.2
N$10160: IC19.1(OUT0) R121.1
N$10161: IC19.2(OUT1) R122.1
N$10162: IC19.3(OUT2) R123.1
N$10163: C72.2 R115.2
N$10164: D6.1(R) R123.2
N$10165: D6.4(B) R122.2
N$10166: D6.3(G) R121.2
N$10888: IC18.1(OUT0) R118.1
N$10889: IC18.2(OUT1) R119.1
N$10890: IC18.3(OUT2) R120.1
N$10891: C71.2 R114.2
N$10892: D5.1(R) R120.2
N$10893: D5.4(B) R119.2
N$10894: D5.3(G) R118.2
PIXEL41: IC14.5(SDO) IC20.6(SDI)
PIXEL42: IC21.5(SDO) ; also sheet 1
PIXEL43: IC15.6(SDI) IC20.5(SDO)
PIXEL44: IC15.5(SDO) IC21.6(SDI)
PIXEL_45: IC16.5(SDO) IC19.6(SDI)
PIXEL_46: IC17.6(SDI) IC19.5(SDO)
PIXEL_47: IC16.6(SDI) IC18.5(SDO)
PIXEL_48: IC17.5(SDO) ; also sheet 3
PIXEL_54: IC18.6(SDI) ; also sheet 3
RST: MCP_010.18(!RESET) ; also sheet 1,3
SPI1_MOSI: IC14.6(SDI) ; also sheet 1
Unconnected: IC14.7(TEST) IC15.7(TEST) IC16.7(TEST) IC17.7(TEST) IC18.7(TEST) IC19.7(TEST) IC20.7(TEST) IC21.7(TEST)

### Notes on the sheet
- MODULATION
- RGB ENCODER 41 | SWITCH RGB 47
- RGB ENCODER 44 | SWITCH RGB 46
- RGB ENCODER 45 | SWITCH RGB 43
- RGB ENCODER 48 | SWITCH RGB 42

## Sheet 3 of 3
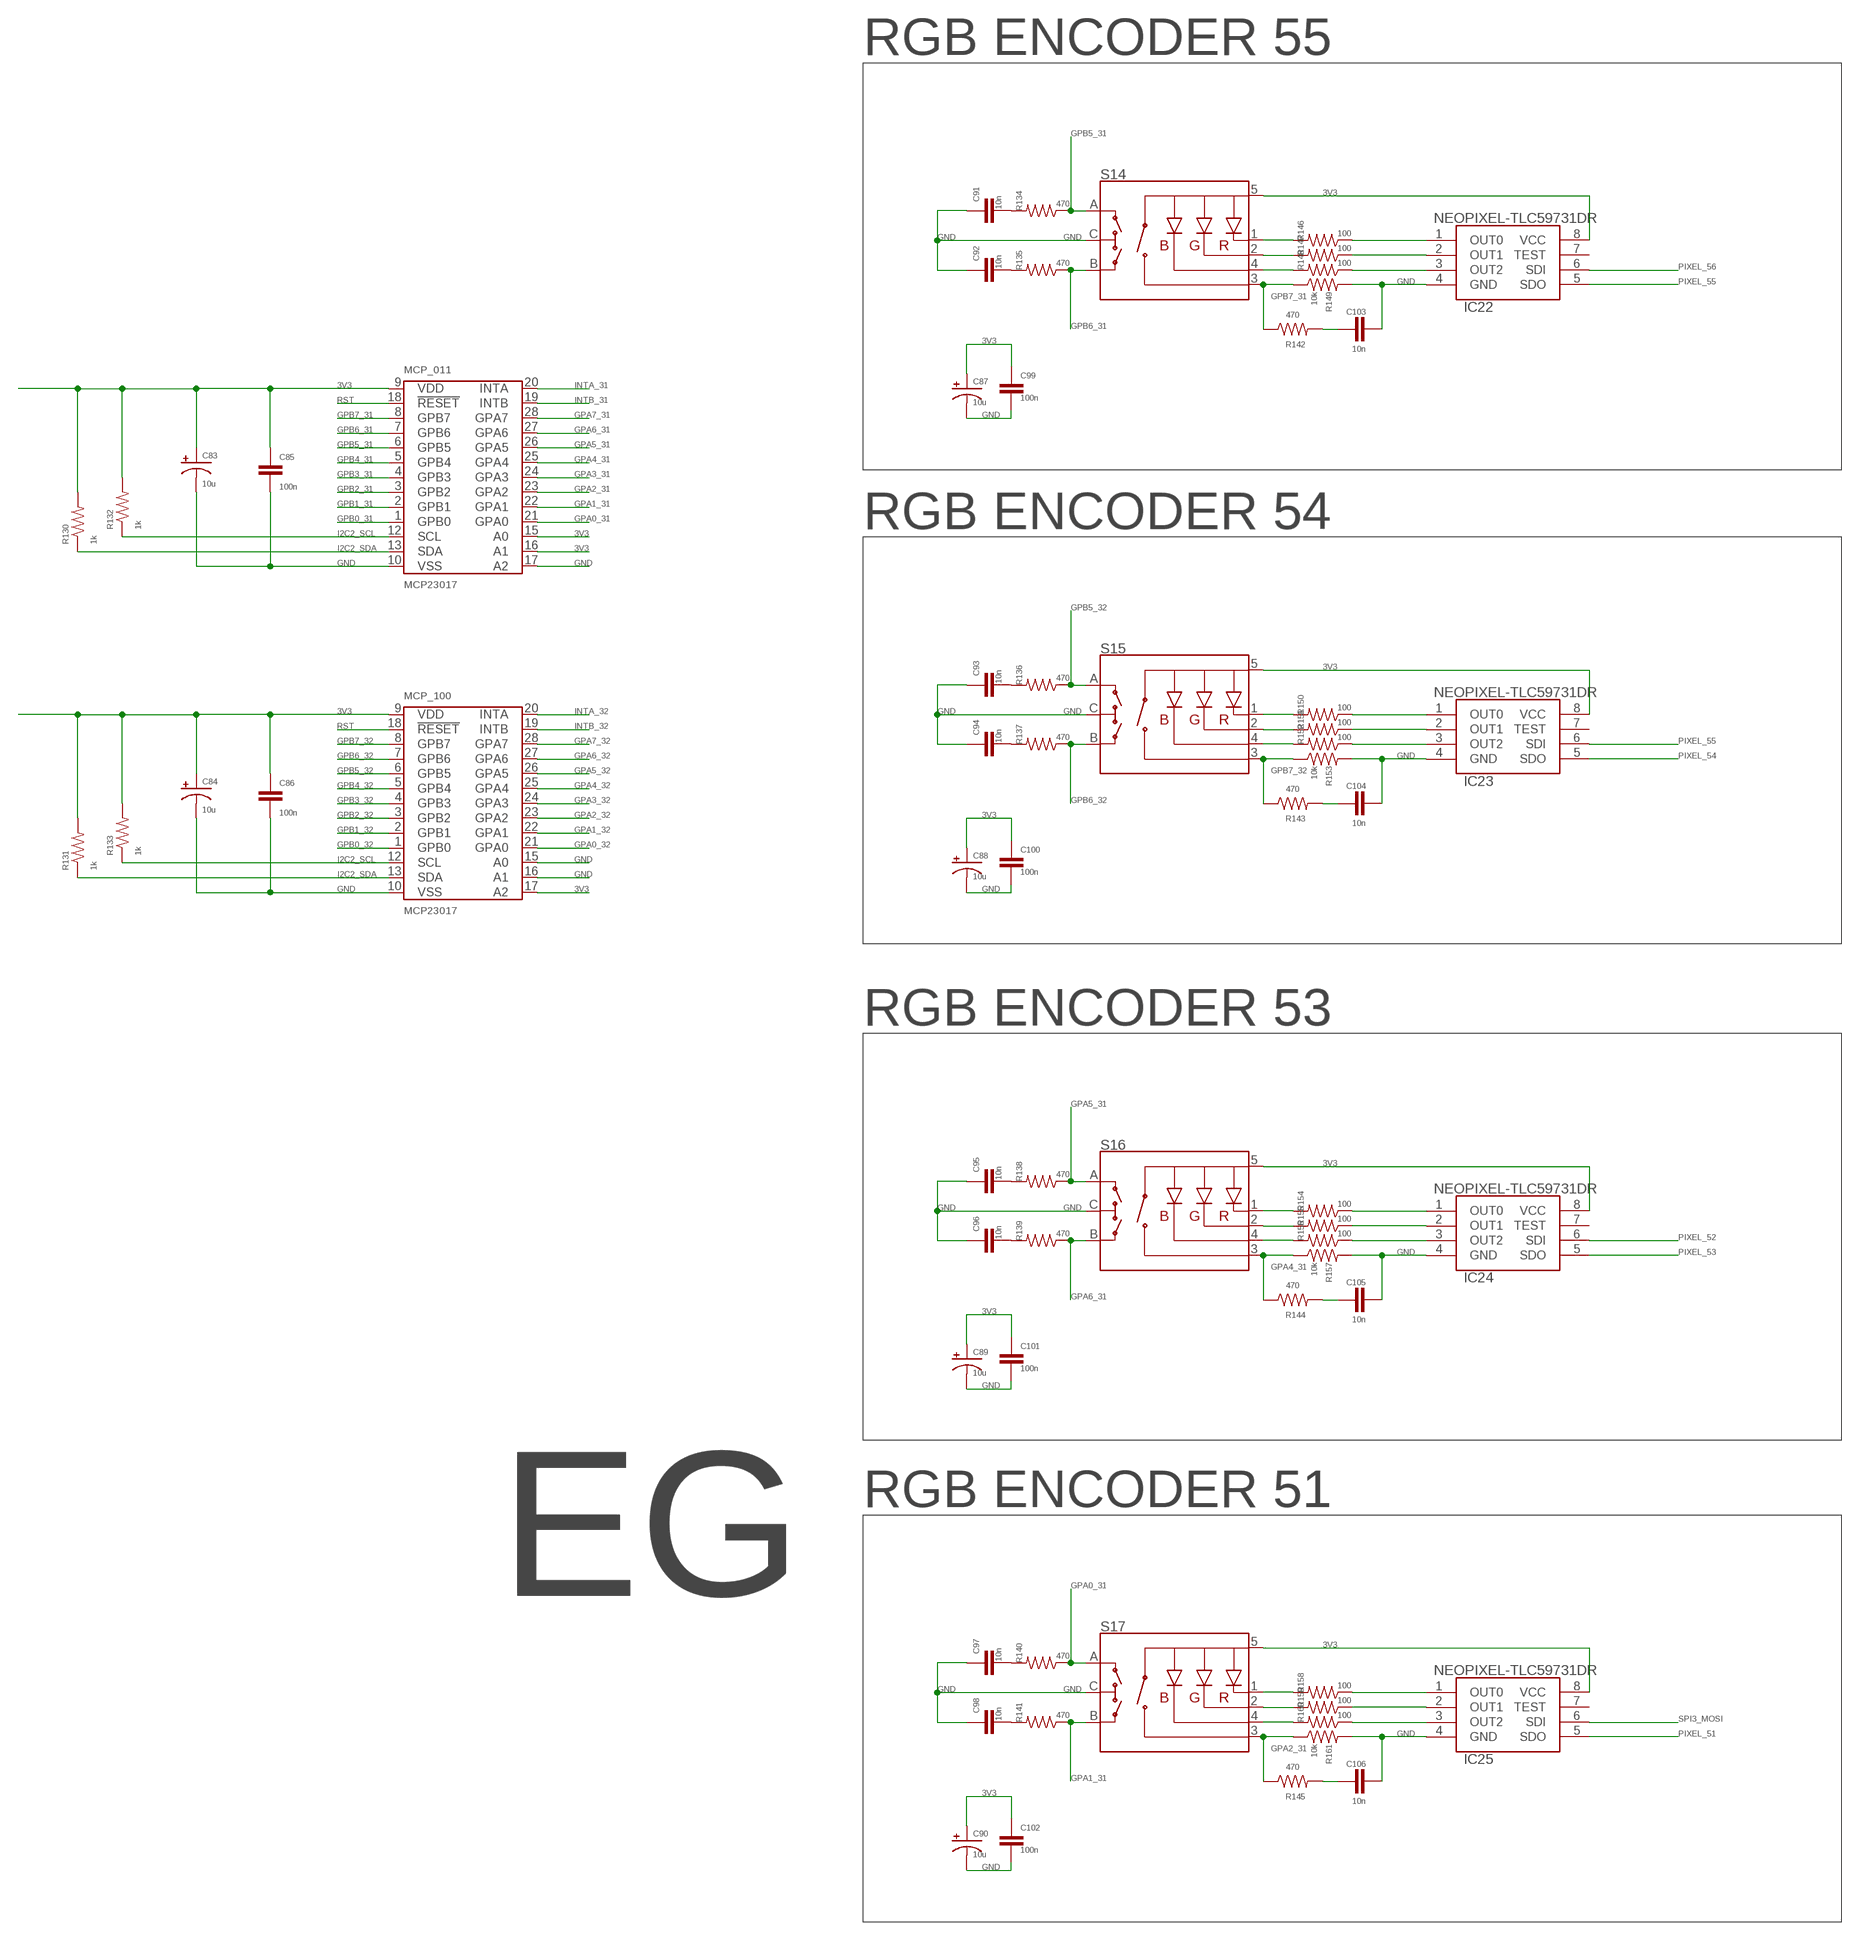
[diagram p7: schematic, sheet 3, part 1 of 2]
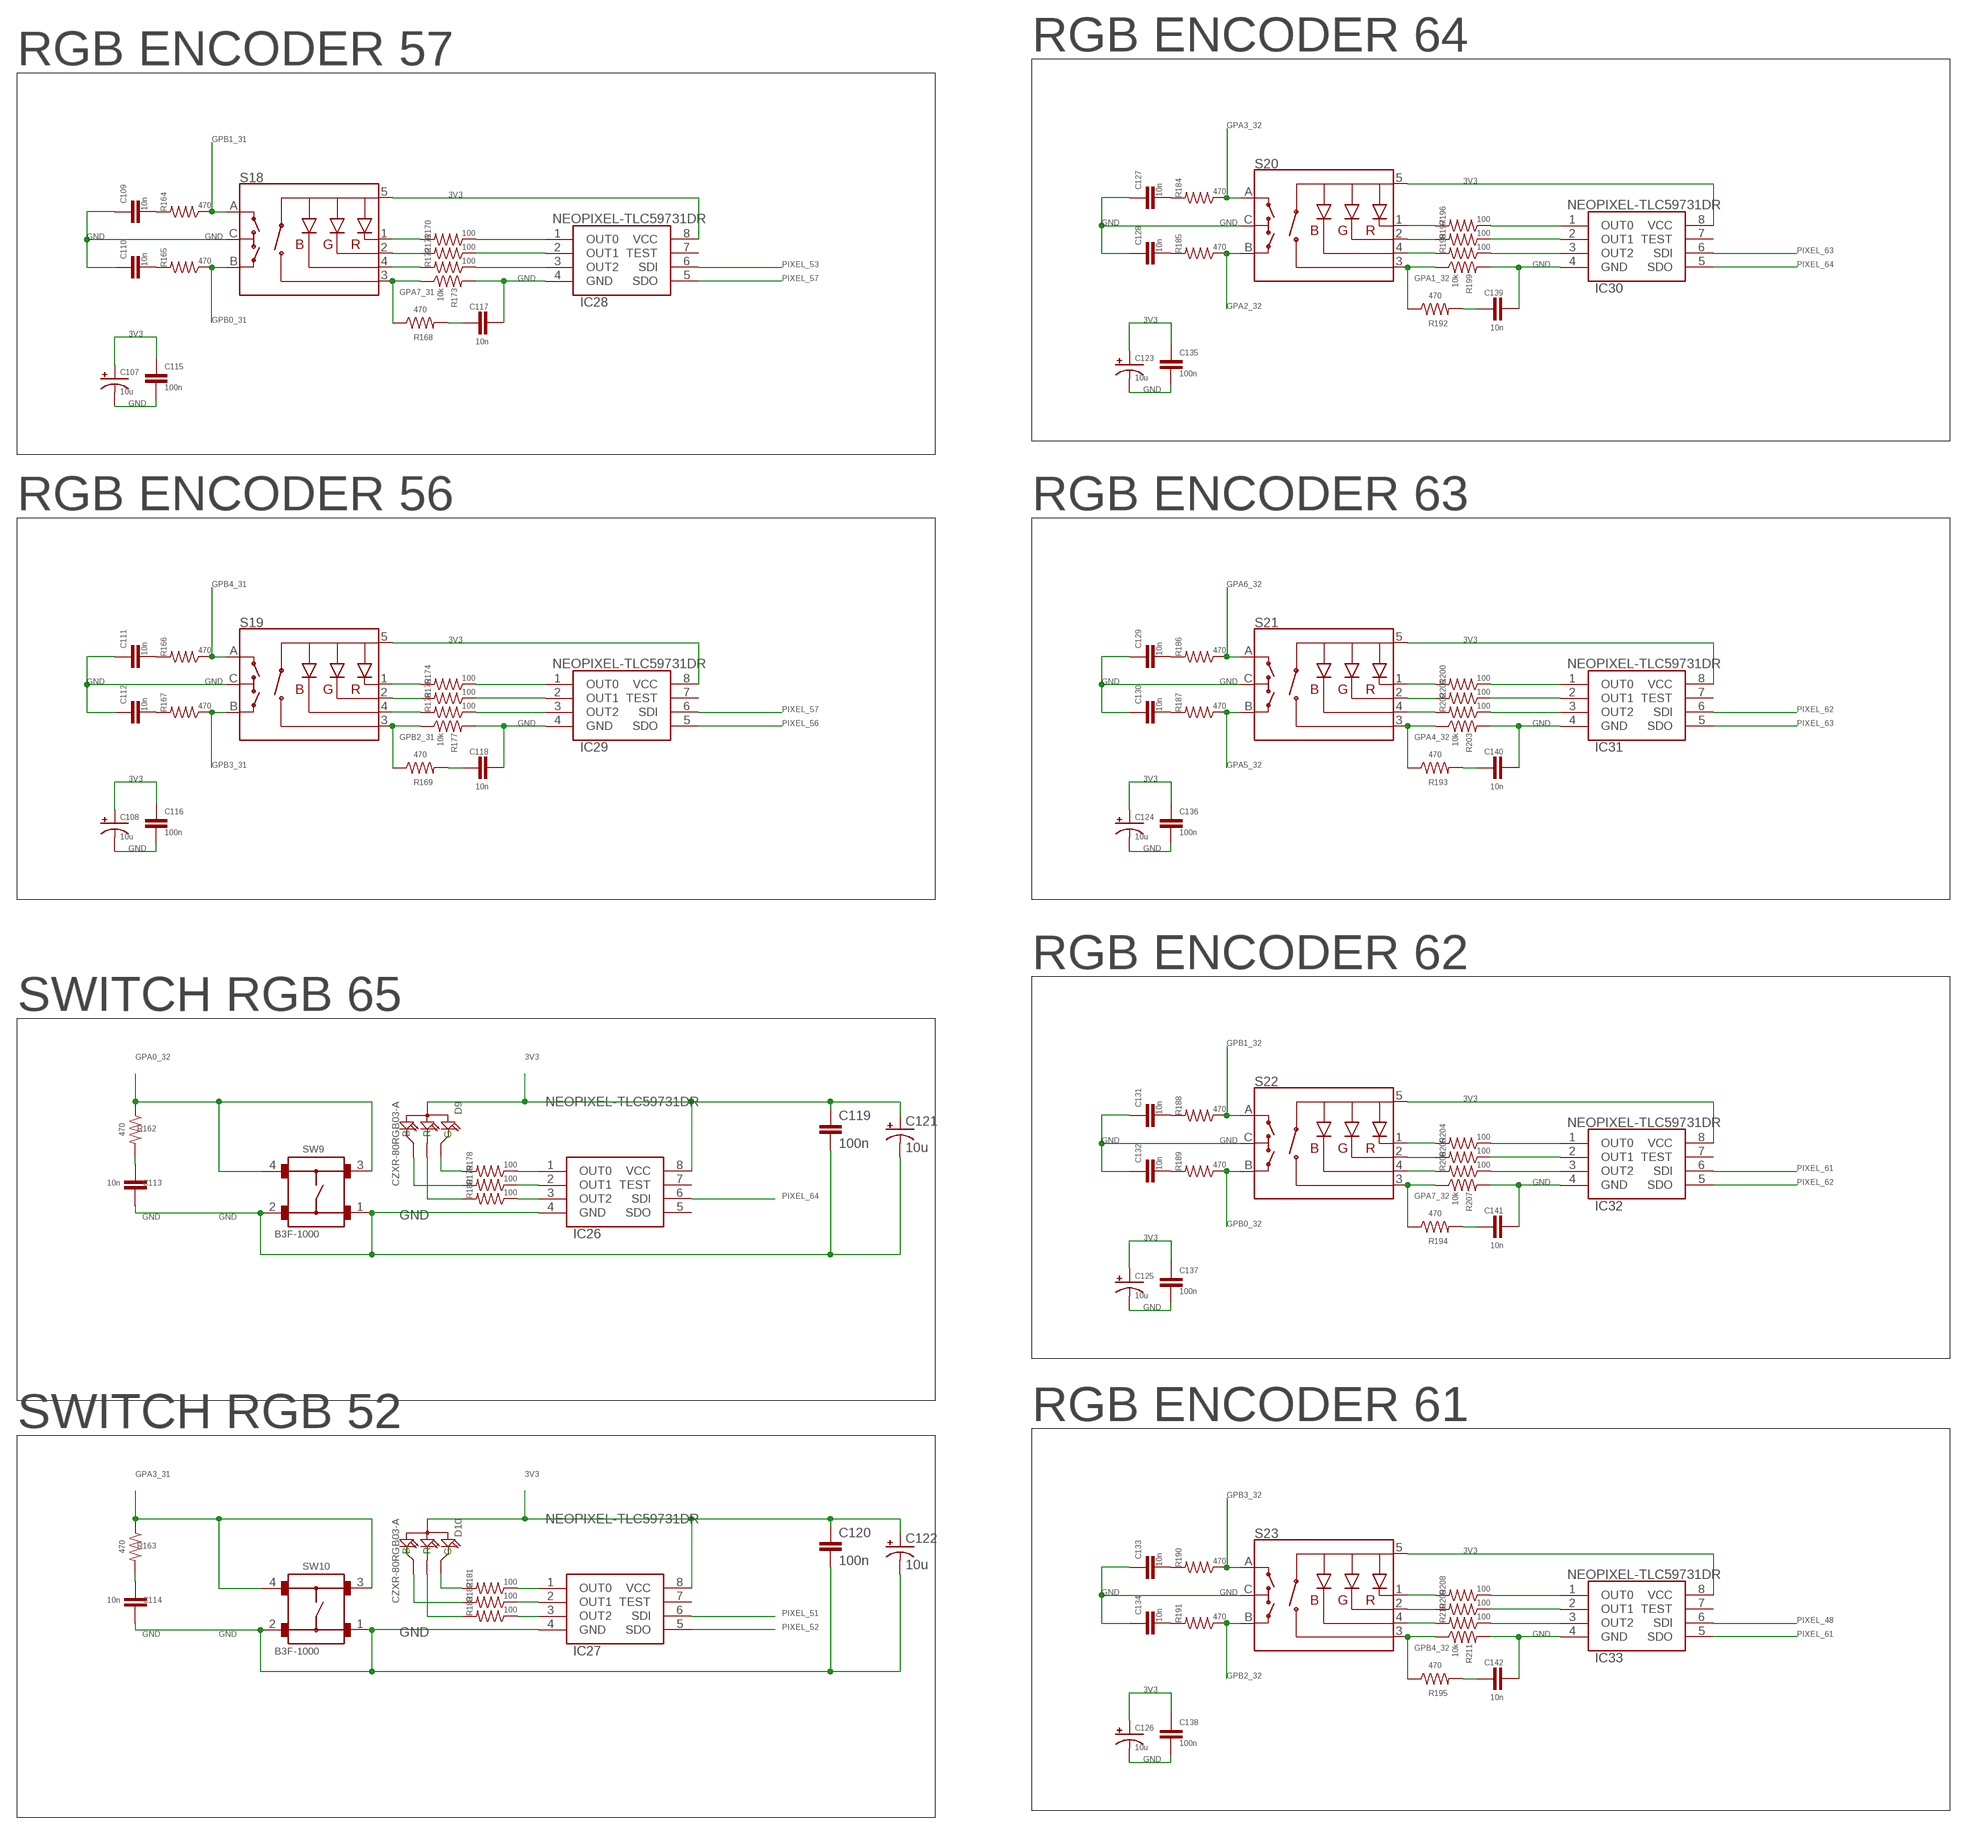
[diagram p8: schematic, sheet 3, part 2 of 2]

### Parts
C83  10u  PASSIF-CPOL-US2917  [CPOL2917]
C84  10u  PASSIF-CPOL-US2917  [CPOL2917]
C85  100n  PASSIF-CAP-0805  [0805-CAP]
C86  100n  PASSIF-CAP-0805  [0805-CAP]
C87  10u  PASSIF-CPOL-US2917  [CPOL2917]
C88  10u  PASSIF-CPOL-US2917  [CPOL2917]
C89  10u  PASSIF-CPOL-US2917  [CPOL2917]
C90  10u  PASSIF-CPOL-US2917  [CPOL2917]
C91  10n  PASSIF-CAP-0805  [0805-CAP]
C92  10n  PASSIF-CAP-0805  [0805-CAP]
C93  10n  PASSIF-CAP-0805  [0805-CAP]
C94  10n  PASSIF-CAP-0805  [0805-CAP]
C95  10n  PASSIF-CAP-0805  [0805-CAP]
C96  10n  PASSIF-CAP-0805  [0805-CAP]
C97  10n  PASSIF-CAP-0805  [0805-CAP]
C98  10n  PASSIF-CAP-0805  [0805-CAP]
C99  100n  PASSIF-CAP-0805  [0805-CAP]
C100  100n  PASSIF-CAP-0805  [0805-CAP]
C101  100n  PASSIF-CAP-0805  [0805-CAP]
C102  100n  PASSIF-CAP-0805  [0805-CAP]
C103  10n  PASSIF-CAP-0805  [0805-CAP]
C104  10n  PASSIF-CAP-0805  [0805-CAP]
C105  10n  PASSIF-CAP-0805  [0805-CAP]
C106  10n  PASSIF-CAP-0805  [0805-CAP]
C107  10u  PASSIF-CPOL-US2917  [CPOL2917]
C108  10u  PASSIF-CPOL-US2917  [CPOL2917]
C109  10n  PASSIF-CAP-0805  [0805-CAP]
C110  10n  PASSIF-CAP-0805  [0805-CAP]
C111  10n  PASSIF-CAP-0805  [0805-CAP]
C112  10n  PASSIF-CAP-0805  [0805-CAP]
C113  10n  PASSIF-CAP-0805  [0805-CAP]
C114  10n  PASSIF-CAP-0805  [0805-CAP]
C115  100n  PASSIF-CAP-0805  [0805-CAP]
C116  100n  PASSIF-CAP-0805  [0805-CAP]
C117  10n  PASSIF-CAP-0805  [0805-CAP]
C118  10n  PASSIF-CAP-0805  [0805-CAP]
C119  100n  PASSIF-CAP-0805  [0805-CAP]
C120  100n  PASSIF-CAP-0805  [0805-CAP]
C121  10u  PASSIF-CPOL-US2917  [CPOL2917]
C122  10u  PASSIF-CPOL-US2917  [CPOL2917]
C123  10u  PASSIF-CPOL-US2917  [CPOL2917]
C124  10u  PASSIF-CPOL-US2917  [CPOL2917]
C125  10u  PASSIF-CPOL-US2917  [CPOL2917]
C126  10u  PASSIF-CPOL-US2917  [CPOL2917]
C127  10n  PASSIF-CAP-0805  [0805-CAP]
C128  10n  PASSIF-CAP-0805  [0805-CAP]
C129  10n  PASSIF-CAP-0805  [0805-CAP]
C130  10n  PASSIF-CAP-0805  [0805-CAP]
C131  10n  PASSIF-CAP-0805  [0805-CAP]
C132  10n  PASSIF-CAP-0805  [0805-CAP]
C133  10n  PASSIF-CAP-0805  [0805-CAP]
C134  10n  PASSIF-CAP-0805  [0805-CAP]
C135  100n  PASSIF-CAP-0805  [0805-CAP]
C136  100n  PASSIF-CAP-0805  [0805-CAP]
C137  100n  PASSIF-CAP-0805  [0805-CAP]
C138  100n  PASSIF-CAP-0805  [0805-CAP]
C139  10n  PASSIF-CAP-0805  [0805-CAP]
C140  10n  PASSIF-CAP-0805  [0805-CAP]
C141  10n  PASSIF-CAP-0805  [0805-CAP]
C142  10n  PASSIF-CAP-0805  [0805-CAP]
D9  CZXR-80RGB03-A  DIP-LED-RGB-COMMON-ANODE(4P-D8MM)  [LED4-2.0-D8.0MM]
D10  CZXR-80RGB03-A  DIP-LED-RGB-COMMON-ANODE(4P-D8MM)  [LED4-2.0-D8.0MM]
IC22  NEOPIXEL-TLC59731DR  [SOIC127P600X175-8N]
IC23  NEOPIXEL-TLC59731DR  [SOIC127P600X175-8N]
IC24  NEOPIXEL-TLC59731DR  [SOIC127P600X175-8N]
IC25  NEOPIXEL-TLC59731DR  [SOIC127P600X175-8N]
IC26  NEOPIXEL-TLC59731DR  [SOIC127P600X175-8N]
IC27  NEOPIXEL-TLC59731DR  [SOIC127P600X175-8N]
IC28  NEOPIXEL-TLC59731DR  [SOIC127P600X175-8N]
IC29  NEOPIXEL-TLC59731DR  [SOIC127P600X175-8N]
IC30  NEOPIXEL-TLC59731DR  [SOIC127P600X175-8N]
IC31  NEOPIXEL-TLC59731DR  [SOIC127P600X175-8N]
IC32  NEOPIXEL-TLC59731DR  [SOIC127P600X175-8N]
IC33  NEOPIXEL-TLC59731DR  [SOIC127P600X175-8N]
MCP_011  MCP23017  [SOIC-28]
MCP_100  MCP23017  [SOIC-28]
R130  1k  R-US_R0805  [R0805]
R131  1k  R-US_R0805  [R0805]
R132  1k  R-US_R0805  [R0805]
R133  1k  R-US_R0805  [R0805]
R134  470  PASSIF-RESISTOR-1206  [1206]
R135  470  PASSIF-RESISTOR-1206  [1206]
R136  470  PASSIF-RESISTOR-1206  [1206]
R137  470  PASSIF-RESISTOR-1206  [1206]
R138  470  PASSIF-RESISTOR-1206  [1206]
R139  470  PASSIF-RESISTOR-1206  [1206]
R140  470  PASSIF-RESISTOR-1206  [1206]
R141  470  PASSIF-RESISTOR-1206  [1206]
R142  470  PASSIF-RESISTOR-1206  [1206]
R143  470  PASSIF-RESISTOR-1206  [1206]
R144  470  PASSIF-RESISTOR-1206  [1206]
R145  470  PASSIF-RESISTOR-1206  [1206]
R146  100  PASSIF-RESISTOR-1206  [1206]
R147  100  PASSIF-RESISTOR-1206  [1206]
R148  100  PASSIF-RESISTOR-1206  [1206]
R149  10k  PASSIF-RESISTOR-1206  [1206]
R150  100  PASSIF-RESISTOR-1206  [1206]
R151  100  PASSIF-RESISTOR-1206  [1206]
R152  100  PASSIF-RESISTOR-1206  [1206]
R153  10k  PASSIF-RESISTOR-1206  [1206]
R154  100  PASSIF-RESISTOR-1206  [1206]
R155  100  PASSIF-RESISTOR-1206  [1206]
R156  100  PASSIF-RESISTOR-1206  [1206]
R157  10k  PASSIF-RESISTOR-1206  [1206]
R158  100  PASSIF-RESISTOR-1206  [1206]
R159  100  PASSIF-RESISTOR-1206  [1206]
R160  100  PASSIF-RESISTOR-1206  [1206]
R161  10k  PASSIF-RESISTOR-1206  [1206]
R162  470  PASSIF-RESISTOR-1206  [1206]
R163  470  PASSIF-RESISTOR-1206  [1206]
R164  470  PASSIF-RESISTOR-1206  [1206]
R165  470  PASSIF-RESISTOR-1206  [1206]
R166  470  PASSIF-RESISTOR-1206  [1206]
R167  470  PASSIF-RESISTOR-1206  [1206]
R168  470  PASSIF-RESISTOR-1206  [1206]
R169  470  PASSIF-RESISTOR-1206  [1206]
R170  100  PASSIF-RESISTOR-1206  [1206]
R171  100  PASSIF-RESISTOR-1206  [1206]
R172  100  PASSIF-RESISTOR-1206  [1206]
R173  10k  PASSIF-RESISTOR-1206  [1206]
R174  100  PASSIF-RESISTOR-1206  [1206]
R175  100  PASSIF-RESISTOR-1206  [1206]
R176  100  PASSIF-RESISTOR-1206  [1206]
R177  10k  PASSIF-RESISTOR-1206  [1206]
R178  100  PASSIF-RESISTOR-1206  [1206]
R179  100  PASSIF-RESISTOR-1206  [1206]
R180  100  PASSIF-RESISTOR-1206  [1206]
R181  100  PASSIF-RESISTOR-1206  [1206]
R182  100  PASSIF-RESISTOR-1206  [1206]
R183  100  PASSIF-RESISTOR-1206  [1206]
R184  470  PASSIF-RESISTOR-1206  [1206]
R185  470  PASSIF-RESISTOR-1206  [1206]
R186  470  PASSIF-RESISTOR-1206  [1206]
R187  470  PASSIF-RESISTOR-1206  [1206]
R188  470  PASSIF-RESISTOR-1206  [1206]
R189  470  PASSIF-RESISTOR-1206  [1206]
R190  470  PASSIF-RESISTOR-1206  [1206]
R191  470  PASSIF-RESISTOR-1206  [1206]
R192  470  PASSIF-RESISTOR-1206  [1206]
R193  470  PASSIF-RESISTOR-1206  [1206]
R194  470  PASSIF-RESISTOR-1206  [1206]
R195  470  PASSIF-RESISTOR-1206  [1206]
R196  100  PASSIF-RESISTOR-1206  [1206]
R197  100  PASSIF-RESISTOR-1206  [1206]
R198  100  PASSIF-RESISTOR-1206  [1206]
R199  10k  PASSIF-RESISTOR-1206  [1206]
R200  100  PASSIF-RESISTOR-1206  [1206]
R201  100  PASSIF-RESISTOR-1206  [1206]
R202  100  PASSIF-RESISTOR-1206  [1206]
R203  10k  PASSIF-RESISTOR-1206  [1206]
R204  100  PASSIF-RESISTOR-1206  [1206]
R205  100  PASSIF-RESISTOR-1206  [1206]
R206  100  PASSIF-RESISTOR-1206  [1206]
R207  10k  PASSIF-RESISTOR-1206  [1206]
R208  100  PASSIF-RESISTOR-1206  [1206]
R209  100  PASSIF-RESISTOR-1206  [1206]
R210  100  PASSIF-RESISTOR-1206  [1206]
R211  10k  PASSIF-RESISTOR-1206  [1206]
S14  ENCODER-RGB-SWITCH-NO_NUT  [ENCODER_LED_3]
S15  ENCODER-RGB-SWITCH-NO_NUT  [ENCODER_LED_3]
S16  ENCODER-RGB-SWITCH-NO_NUT  [ENCODER_LED_3]
S17  ENCODER-RGB-SWITCH-NO_NUT  [ENCODER_LED_3]
S18  ENCODER-RGB-SWITCH-NO_NUT  [ENCODER_LED_3]
S19  ENCODER-RGB-SWITCH-NO_NUT  [ENCODER_LED_3]
S20  ENCODER-RGB-SWITCH-NO_NUT  [ENCODER_LED_3]
S21  ENCODER-RGB-SWITCH-NO_NUT  [ENCODER_LED_3]
S22  ENCODER-RGB-SWITCH-NO_NUT  [ENCODER_LED_3]
S23  ENCODER-RGB-SWITCH-NO_NUT  [ENCODER_LED_3]
SW9  B3F-1000  [B3F-1000]
SW10  B3F-1000  [B3F-1000]

### Nets
3V3: C83.+ C84.+ C85.1 C86.1 C87.+ C88.+ C89.+ C90.+ C99.1 C100.1 C101.1 C102.1 C107.+ C108.+ C115.1 C116.1 C119.1 C120.1 C121.+ C122.+ C123.+ C124.+ C125.+ C126.+ C135.1 C136.1 C137.1 C138.1 D9.2(+) D10.2(+) IC22.8(VCC) IC23.8(VCC) IC24.8(VCC) IC25.8(VCC) IC26.8(VCC) IC27.8(VCC) IC28.8(VCC) IC29.8(VCC) IC30.8(VCC) IC31.8(VCC) IC32.8(VCC) IC33.8(VCC) MCP_011.9(VDD) MCP_011.15(A0) MCP_011.16(A1) MCP_100.9(VDD) MCP_100.17(A2) R130.2 R131.2 R132.2 R133.2 S14.5(+) S15.5(+) S16.5(+) S17.5(+) S18.5(+) S19.5(+) S20.5(+) S21.5(+) S22.5(+) S23.5(+) ; also sheet 1,2
GND: C83.- C84.- C85.2 C86.2 C87.- C88.- C89.- C90.- C91.1 C92.1 C93.1 C94.1 C95.1 C96.1 C97.1 C98.1 C99.2 C100.2 C101.2 C102.2 C103.2 C104.2 C105.2 C106.2 C107.- C108.- C109.1 C110.1 C111.1 C112.1 C113.1 C114.1 C115.2 C116.2 C117.2 C118.2 C119.2 C120.2 C121.- C122.- C123.- C124.- C125.- C126.- C127.1 C128.1 C129.1 C130.1 C131.1 C132.1 C133.1 C134.1 C135.2 C136.2 C137.2 C138.2 C139.2 C140.2 C141.2 C142.2 IC22.4(GND) IC23.4(GND) IC24.4(GND) IC25.4(GND) IC26.4(GND) IC27.4(GND) IC28.4(GND) IC29.4(GND) IC30.4(GND) IC31.4(GND) IC32.4(GND) IC33.4(GND) MCP_011.10(VSS) MCP_011.17(A2) MCP_100.10(VSS) MCP_100.15(A0) MCP_100.16(A1) R149.2 R153.2 R157.2 R161.2 R173.2 R177.2 R199.2 R203.2 R207.2 R211.2 S14.C S15.C S16.C S17.C S18.C S19.C S20.C S21.C S22.C S23.C SW9.1 SW9.2 SW10.1 SW10.2 ; also sheet 1,2
GPA0_31: MCP_011.21(GPA0) R140.1 S17.A
GPA0_32: MCP_100.21(GPA0) R162.1 SW9.3 SW9.4
GPA1_31: MCP_011.22(GPA1) R141.1 S17.B
GPA1_32: MCP_100.22(GPA1) R192.1 R199.1 S20.3(SW)
GPA2_31: MCP_011.23(GPA2) R145.1 R161.1 S17.3(SW)
GPA2_32: MCP_100.23(GPA2) R185.1 S20.B
GPA3_31: MCP_011.24(GPA3) R163.1 SW10.3 SW10.4
GPA3_32: MCP_100.24(GPA3) R184.1 S20.A
GPA4_31: MCP_011.25(GPA4) R144.1 R157.1 S16.3(SW)
GPA4_32: MCP_100.25(GPA4) R193.1 R203.1 S21.3(SW)
GPA5_31: MCP_011.26(GPA5) R138.1 S16.A
GPA5_32: MCP_100.26(GPA5) R187.1 S21.B
GPA6_31: MCP_011.27(GPA6) R139.1 S16.B
GPA6_32: MCP_100.27(GPA6) R186.1 S21.A
GPA7_31: MCP_011.28(GPA7) R168.1 R173.1 S18.3(SW)
GPA7_32: MCP_100.28(GPA7) R194.1 R207.1 S22.3(SW)
GPB0_31: MCP_011.1(GPB0) R165.1 S18.B
GPB0_32: MCP_100.1(GPB0) R189.1 S22.B
GPB1_31: MCP_011.2(GPB1) R164.1 S18.A
GPB1_32: MCP_100.2(GPB1) R188.1 S22.A
GPB2_31: MCP_011.3(GPB2) R169.1 R177.1 S19.3(SW)
GPB2_32: MCP_100.3(GPB2) R191.1 S23.B
GPB3_31: MCP_011.4(GPB3) R167.1 S19.B
GPB3_32: MCP_100.4(GPB3) R190.1 S23.A
GPB4_31: MCP_011.5(GPB4) R166.1 S19.A
GPB4_32: MCP_100.5(GPB4) R195.1 R211.1 S23.3(SW)
GPB5_31: MCP_011.6(GPB5) R134.1 S14.A
GPB5_32: MCP_100.6(GPB5) R136.1 S15.A
GPB6_31: MCP_011.7(GPB6) R135.1 S14.B
GPB6_32: MCP_100.7(GPB6) R137.1 S15.B
GPB7_31: MCP_011.8(GPB7) R142.1 R149.1 S14.3(SW)
GPB7_32: MCP_100.8(GPB7) R143.1 R153.1 S15.3(SW)
I2C2_SCL: MCP_011.12(SCL) MCP_100.12(SCL) R132.1 R133.1 ; also sheet 1,2
I2C2_SDA: MCP_011.13(SDA) MCP_100.13(SDA) R130.1 R131.1 ; also sheet 1,2
INTA_31: MCP_011.20(INTA) ; also sheet 1
INTA_32: MCP_100.20(INTA) ; also sheet 1
INTB_31: MCP_011.19(INTB) ; also sheet 1
INTB_32: MCP_100.19(INTB) ; also sheet 1
N$1979: R158.2 S17.1(-R)
N$1980: R159.2 S17.2(-G)
N$1981: R160.2 S17.4(-B)
N$1982: IC25.1(OUT0) R158.1
N$1983: IC25.2(OUT1) R159.1
N$2167: IC25.3(OUT2) R160.1
N$2168: C97.2 R140.2
N$2169: C98.2 R141.2
N$2170: C106.1 R145.2
N$3439: R154.2 S16.1(-R)
N$3440: R155.2 S16.2(-G)
N$3441: R156.2 S16.4(-B)
N$3442: IC24.1(OUT0) R154.1
N$3443: IC24.2(OUT1) R155.1
N$3444: IC24.3(OUT2) R156.1
N$3445: C95.2 R138.2
N$3446: C96.2 R139.2
N$3447: C105.1 R144.2
N$5050: R150.2 S15.1(-R)
N$5051: R151.2 S15.2(-G)
N$5052: R152.2 S15.4(-B)
N$5053: IC23.1(OUT0) R150.1
N$5054: IC23.2(OUT1) R151.1
N$5055: IC23.3(OUT2) R152.1
N$5056: C93.2 R136.2
N$5057: C94.2 R137.2
N$5058: C104.1 R143.2
N$5599: R146.2 S14.1(-R)
N$5600: R147.2 S14.2(-G)
N$5601: R148.2 S14.4(-B)
N$5602: IC22.1(OUT0) R146.1
N$5603: IC22.2(OUT1) R147.1
N$5604: IC22.3(OUT2) R148.1
N$5605: C91.2 R134.2
N$5606: C92.2 R135.2
N$5607: C103.1 R142.2
N$5965: R174.2 S19.1(-R)
N$5966: R175.2 S19.2(-G)
N$5967: R176.2 S19.4(-B)
N$5968: IC29.1(OUT0) R174.1
N$5969: IC29.2(OUT1) R175.1
N$5970: IC29.3(OUT2) R176.1
N$5971: C111.2 R166.2
N$5972: C112.2 R167.2
N$5973: C118.1 R169.2
N$6327: IC27.1(OUT0) R181.1
N$6328: IC27.2(OUT1) R182.1
N$6329: IC27.3(OUT2) R183.1
N$6330: C114.2 R163.2
N$6331: R170.2 S18.1(-R)
N$6332: R171.2 S18.2(-G)
N$6333: R172.2 S18.4(-B)
N$6334: IC28.1(OUT0) R170.1
N$6335: IC28.2(OUT1) R171.1
N$6336: IC28.3(OUT2) R172.1
N$6337: C109.2 R164.2
N$6338: C110.2 R165.2
N$6339: C117.1 R168.2
N$6697: R208.2 S23.1(-R)
N$6698: R209.2 S23.2(-G)
N$6699: R210.2 S23.4(-B)
N$6700: IC33.1(OUT0) R208.1
N$6701: IC33.2(OUT1) R209.1
N$6702: IC33.3(OUT2) R210.1
N$6703: C133.2 R190.2
N$6704: C134.2 R191.2
N$6705: C142.1 R195.2
N$7063: R204.2 S22.1(-R)
N$7064: R205.2 S22.2(-G)
N$7065: R206.2 S22.4(-B)
N$7066: IC32.1(OUT0) R204.1
N$7067: IC32.2(OUT1) R205.1
N$7068: IC32.3(OUT2) R206.1
N$7069: C131.2 R188.2
N$7070: C132.2 R189.2
N$7071: C141.1 R194.2
N$7429: R200.2 S21.1(-R)
N$7430: R201.2 S21.2(-G)
N$7431: R202.2 S21.4(-B)
N$7432: IC31.1(OUT0) R200.1
N$7433: IC31.2(OUT1) R201.1
N$7434: IC31.3(OUT2) R202.1
N$7435: C129.2 R186.2
N$7436: C130.2 R187.2
N$7437: C140.1 R193.2
N$7612: D10.1(R) R183.2
N$7613: D10.4(B) R182.2
N$7614: D10.3(G) R181.2
N$7795: R196.2 S20.1(-R)
N$7796: R197.2 S20.2(-G)
N$7797: R198.2 S20.4(-B)
N$7798: IC30.1(OUT0) R196.1
N$7799: IC30.2(OUT1) R197.1
N$7800: IC30.3(OUT2) R198.1
N$7801: C127.2 R184.2
N$7802: C128.2 R185.2
N$7803: C139.1 R192.2
N$8885: IC26.1(OUT0) R178.1
N$8886: IC26.2(OUT1) R179.1
N$8887: IC26.3(OUT2) R180.1
N$8888: C113.2 R162.2
N$8889: D9.1(R) R180.2
N$8890: D9.4(B) R179.2
N$8891: D9.3(G) R178.2
PIXEL_48: IC33.6(SDI) ; also sheet 2
PIXEL_51: IC25.5(SDO) IC27.6(SDI)
PIXEL_52: IC24.6(SDI) IC27.5(SDO)
PIXEL_53: IC24.5(SDO) IC28.6(SDI)
PIXEL_54: IC23.5(SDO) ; also sheet 2
PIXEL_55: IC22.5(SDO) IC23.6(SDI)
PIXEL_56: IC22.6(SDI) IC29.5(SDO)
PIXEL_57: IC28.5(SDO) IC29.6(SDI)
PIXEL_61: IC32.6(SDI) IC33.5(SDO)
PIXEL_62: IC31.6(SDI) IC32.5(SDO)
PIXEL_63: IC30.6(SDI) IC31.5(SDO)
PIXEL_64: IC26.6(SDI) IC30.5(SDO)
RST: MCP_011.18(!RESET) MCP_100.18(!RESET) ; also sheet 1,2
SPI3_MOSI: IC25.6(SDI) ; also sheet 1
Unconnected: IC22.7(TEST) IC23.7(TEST) IC24.7(TEST) IC25.7(TEST) IC26.5(SDO) IC26.7(TEST) IC27.7(TEST) IC28.7(TEST) IC29.7(TEST) IC30.7(TEST) IC31.7(TEST) IC32.7(TEST) IC33.7(TEST)

### Notes on the sheet
- RGB ENCODER 55 | RGB ENCODER 57 | RGB ENCODER 64
- RGB ENCODER 54 | RGB ENCODER 56 | RGB ENCODER 63
- RGB ENCODER 53 | RGB ENCODER 62
- SWITCH RGB 65
- RGB ENCODER 51 | SWITCH RGB 52 | RGB ENCODER 61
- EG

## Library data of the parts
C1 C4-C48 C50 C55-C78 C85 C86 C91-C106 C109-C120 C127-C142 = stock-perso:PASSIF-CAP
C2 C3 C49 C51-C54 C79-C84 C87-C90 C107 C108 C121-C126 = stock-perso:PASSIF-CPOL-US: SMT Tantalum Capacitor; MOUSER: 581-TPSE477K010R0200
CON_NORTH_BRD = MyComponents:MA10-2: Headers & Wire Housing, 2 Row, 20 Position; OC_FARNELL: unknown; OC_NEWARK: unknown
D1-D10 = OPL_Optoelectronics:DIP-LED-RGB-COMMON-ANODE(4P-D8MM): 304090065; MPN: CZXR-80RGB03-A
IC1-IC33 = stock-perso:NEOPIXEL-TLC59731DR: 3-Channel, 8-Bit, PWM LED Driver with Single-Wire Interface (similaire à du neopixel) Source: Datasheet <http://www.ti.com/lit/gpn/tlc59731>; ARROW_PART_NUMBER: TLC59731DR; ARROW_PRICE-STOCK: https://www.arrow.com/en/products/tlc59731dr/texas-instruments; DESCRIPTION: 3-Channel, 8-Bit, PWM LED Driver with Single-Wire Interface; HEIGHT: 1.75mm; MANUFACTURER_NAME: Texas Instruments; MANUFACTURER_PART_NUMBER: TLC59731DR; MOUSER_PART_NUMBER: 595-TLC59731DR; MOUSER_PRICE-STOCK: https://www.mouser.co.uk/ProductDetail/Texas-Instruments/TLC59731DR?qs=s44pgLhgXQgiW%2FpyLmUsDA%3D%3D
MCP_000 MCP_001 MCP_010 MCP_011 MCP_100 = a_ranger_work:MCP23017
R1-R4 R84 R85 R130-R133 = 6P1_EVB:R-US_: RESISTOR, American symbol
R5-R83 R86-R129 R134-R211 = stock-perso:PASSIF-RESISTOR
S1-S23 = stock-perso:ENCODER-RGB-SWITCH: Illuminated Rotary Encoder w/ RGB LED and select switch Encoders rotate similarly to potentiometers, but they’re different from potentiometers in that an encoder has full rotation without limits. They output gray code so that you can tell how much and in which direction the encoder has been turned. This encoder includes an RGB LED and a push-down select switch. Part #: Top Up EC12PLRGBSDVBF-D <http://top-up.so-buy.com/front/bin/ptdetail.phtml?Part=EC12PLRGBSDVBF-D> SparkFun Products Rotary Encoder - Illuminated (RGB) <https://www.sparkfun.com/products/10982> (COM-10982); PROD_ID: RES-14168
SW1-SW10 = Switch:B3F-1000: Tactile Switch SPST-NO Top Actuated Through Hole Manufacturer's datasheet <https://omronfs.omron.com/en_US/ecb/products/pdf/en-b3f.pdf>; CREATED_BY: PCBLayout.com; DIGI_KEY_PART_NUMBER: SW400-ND; MANUFACTURER: Omron Electronics Inc-EMC Div; MPN: B3F-1000; PACKAGE: SPST-NO